# EAGLE board warp-revA (EAGLE 8.6.3)
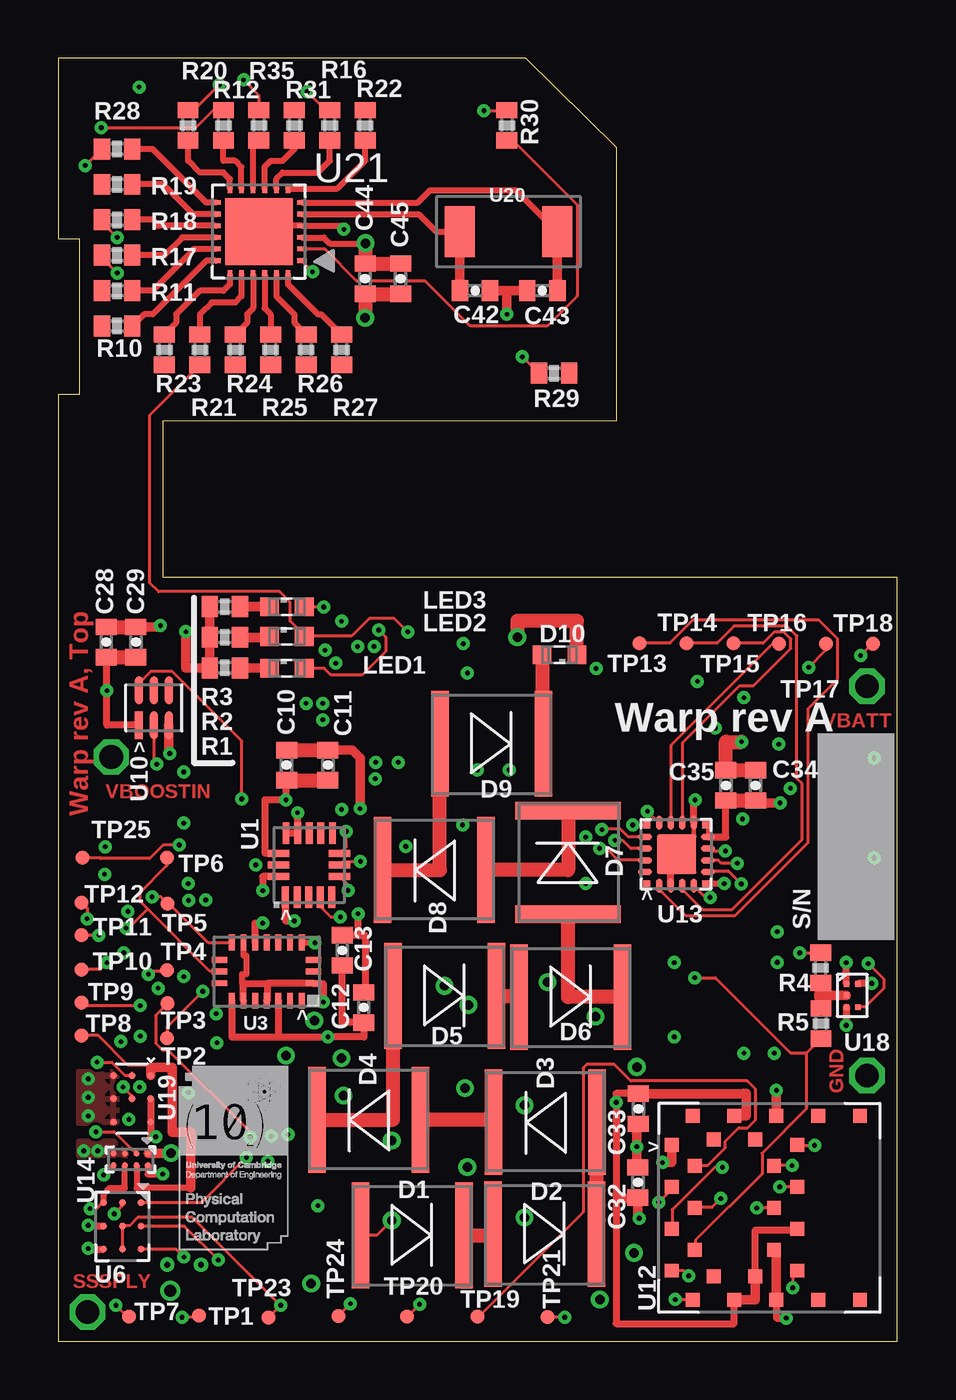
[diagram p5: board, top side]
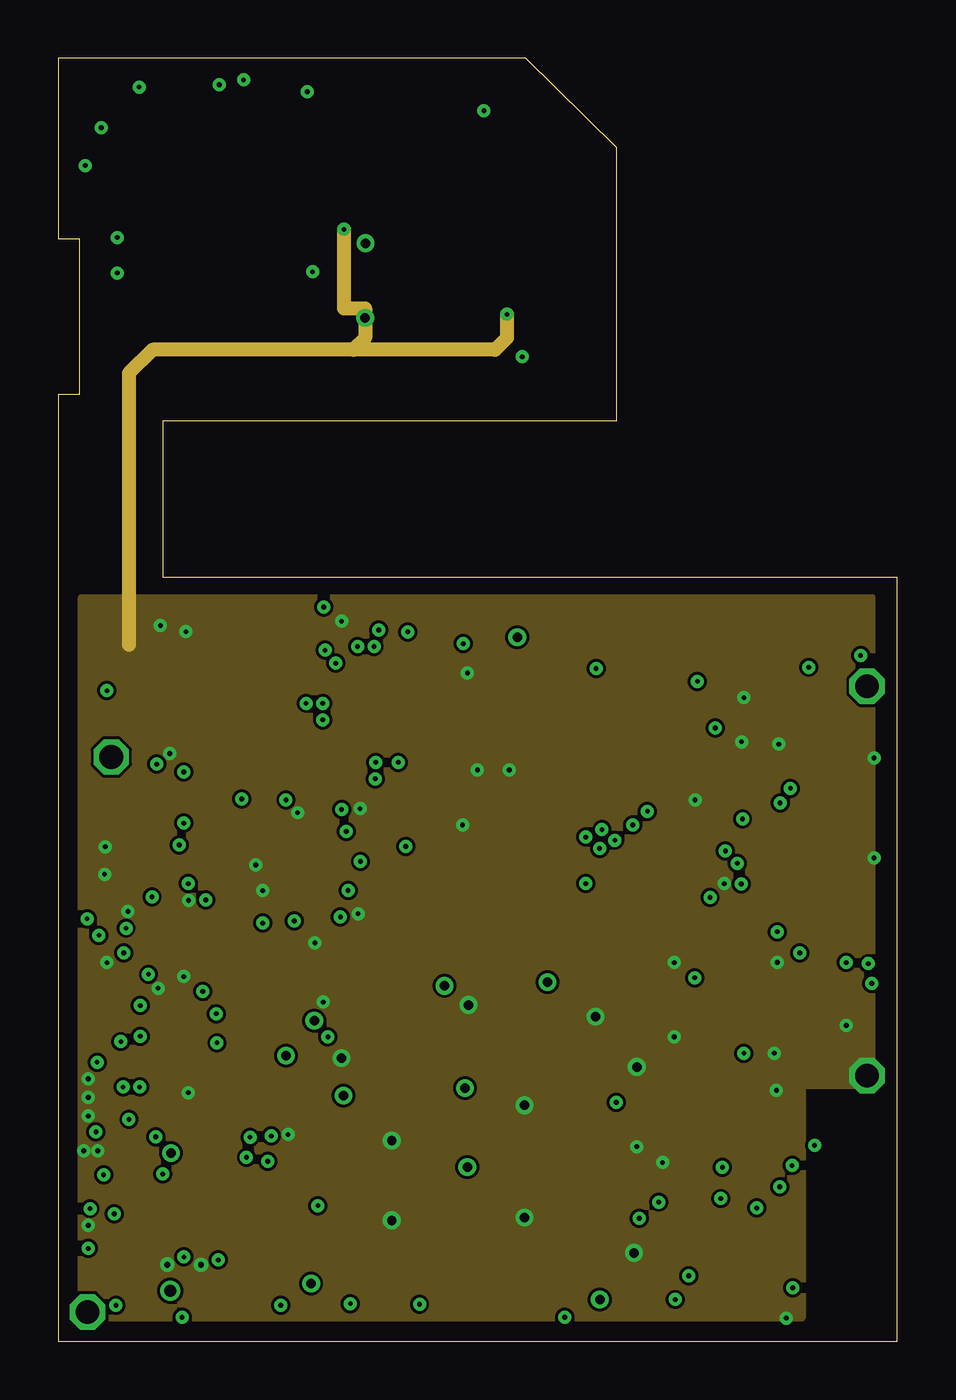
[diagram p6: board, inner layer Route2]
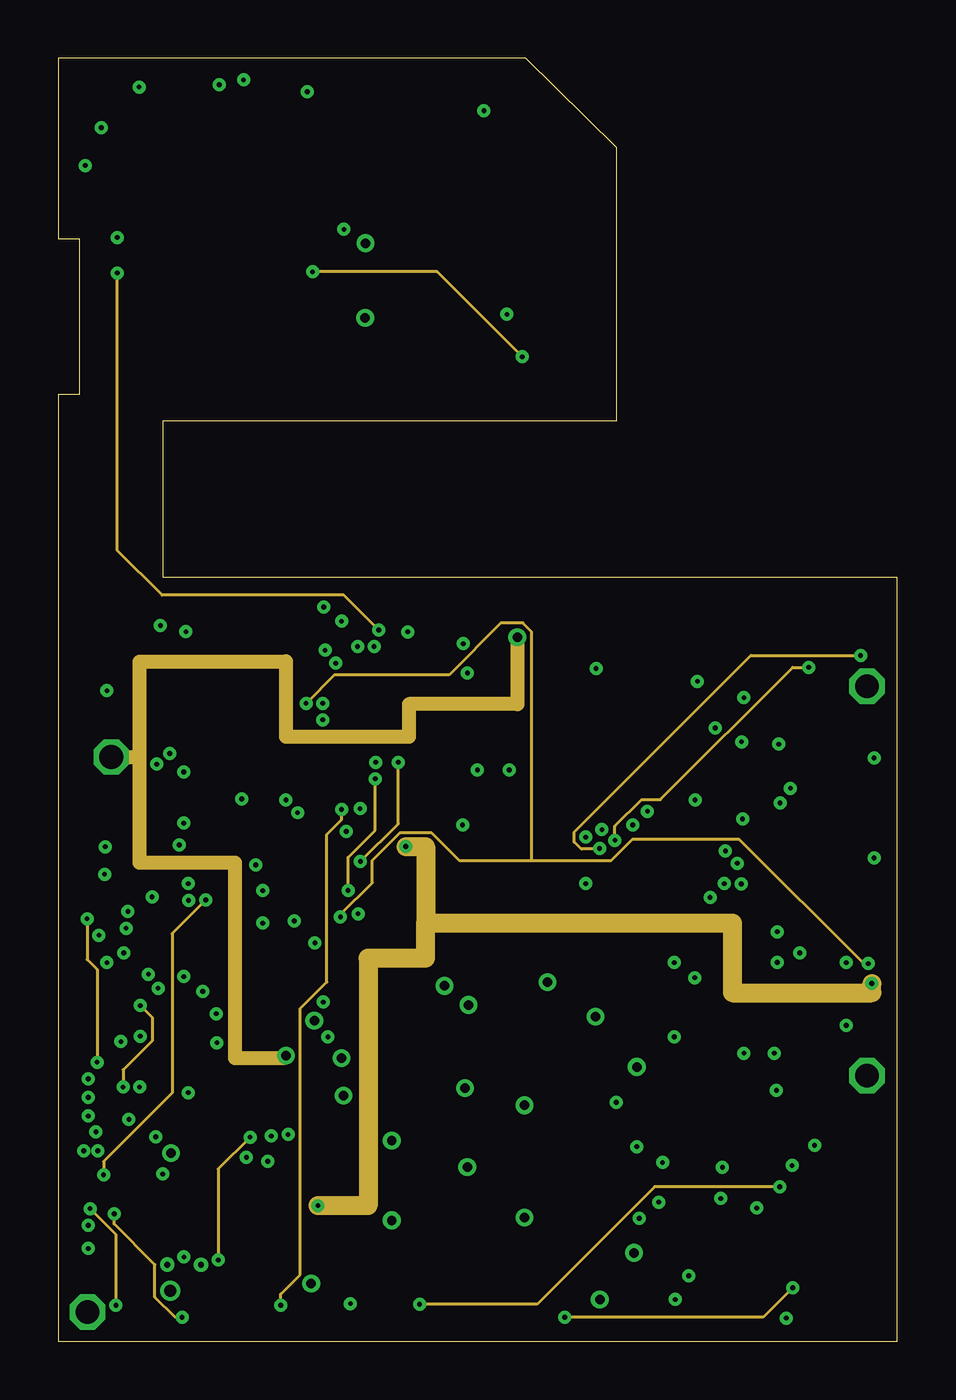
[diagram p7: board, inner layer Route3]
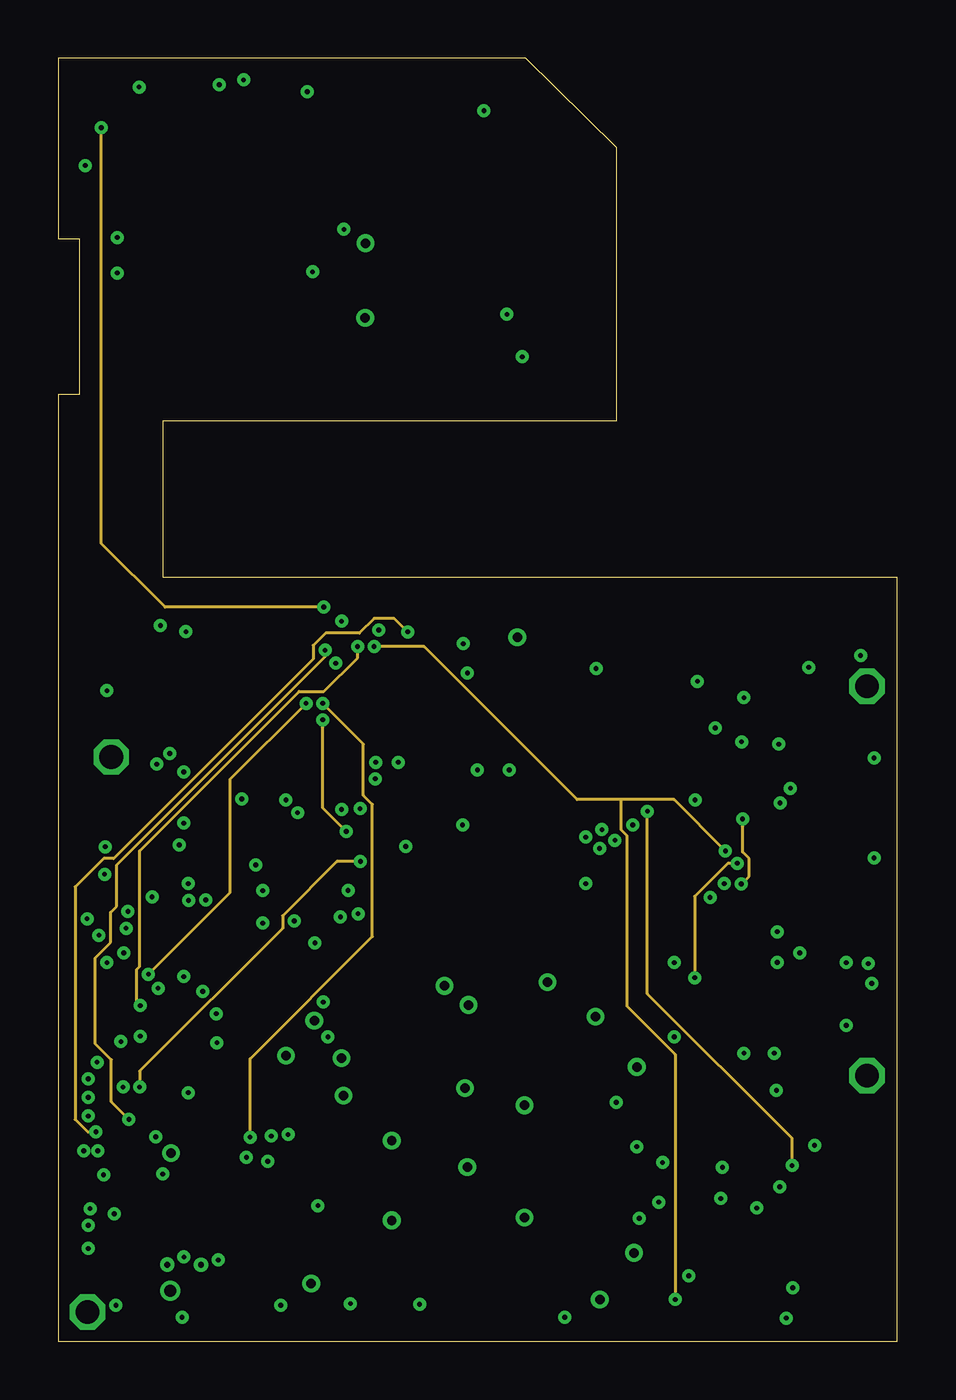
[diagram p8: board, inner layer Route4]
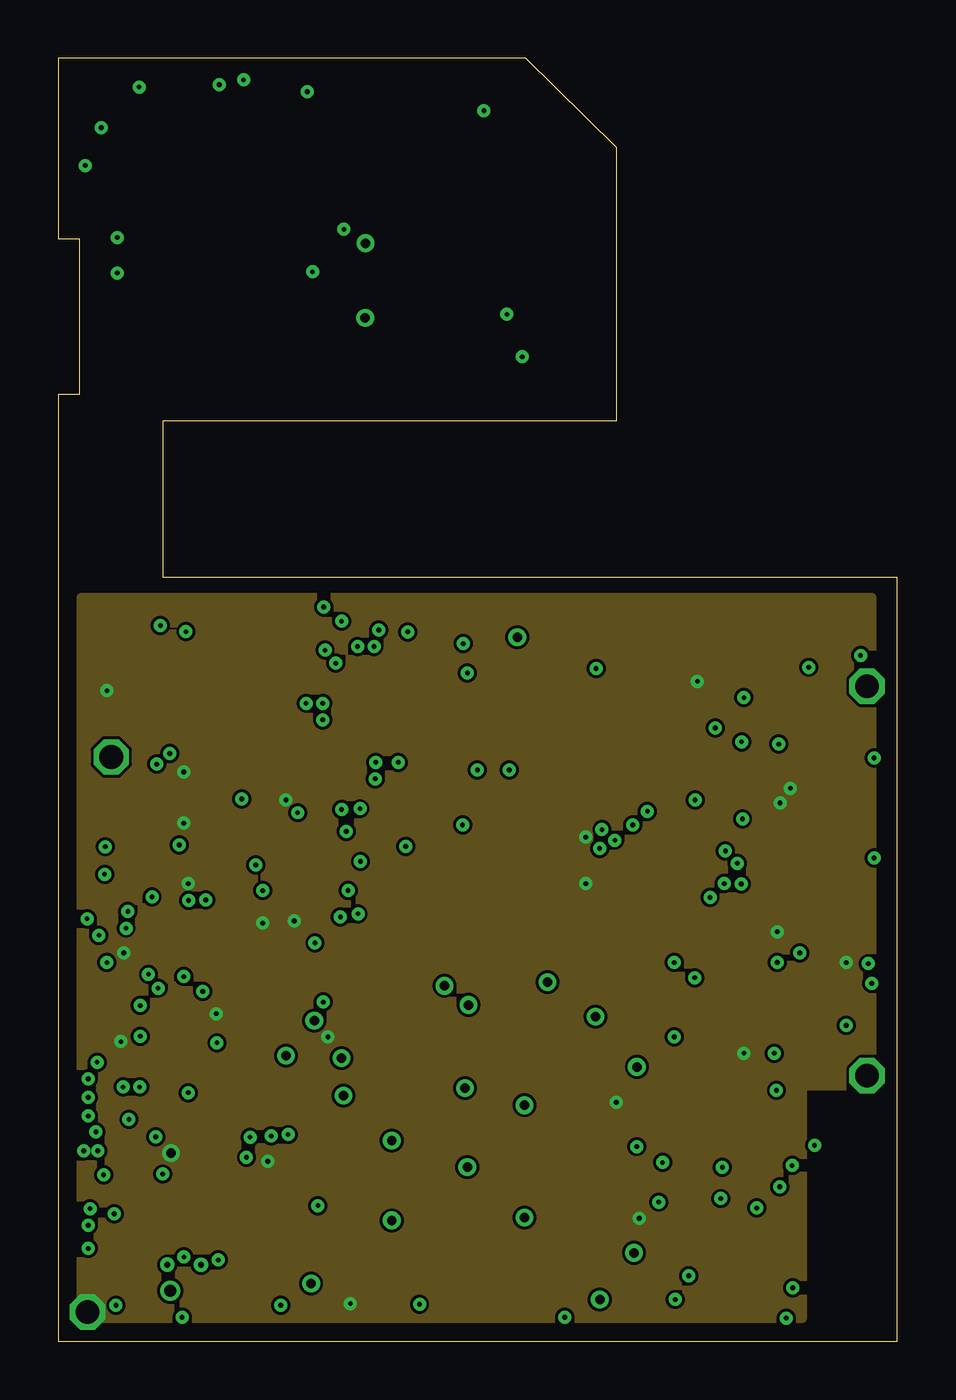
[diagram p9: board, inner layer Route5]
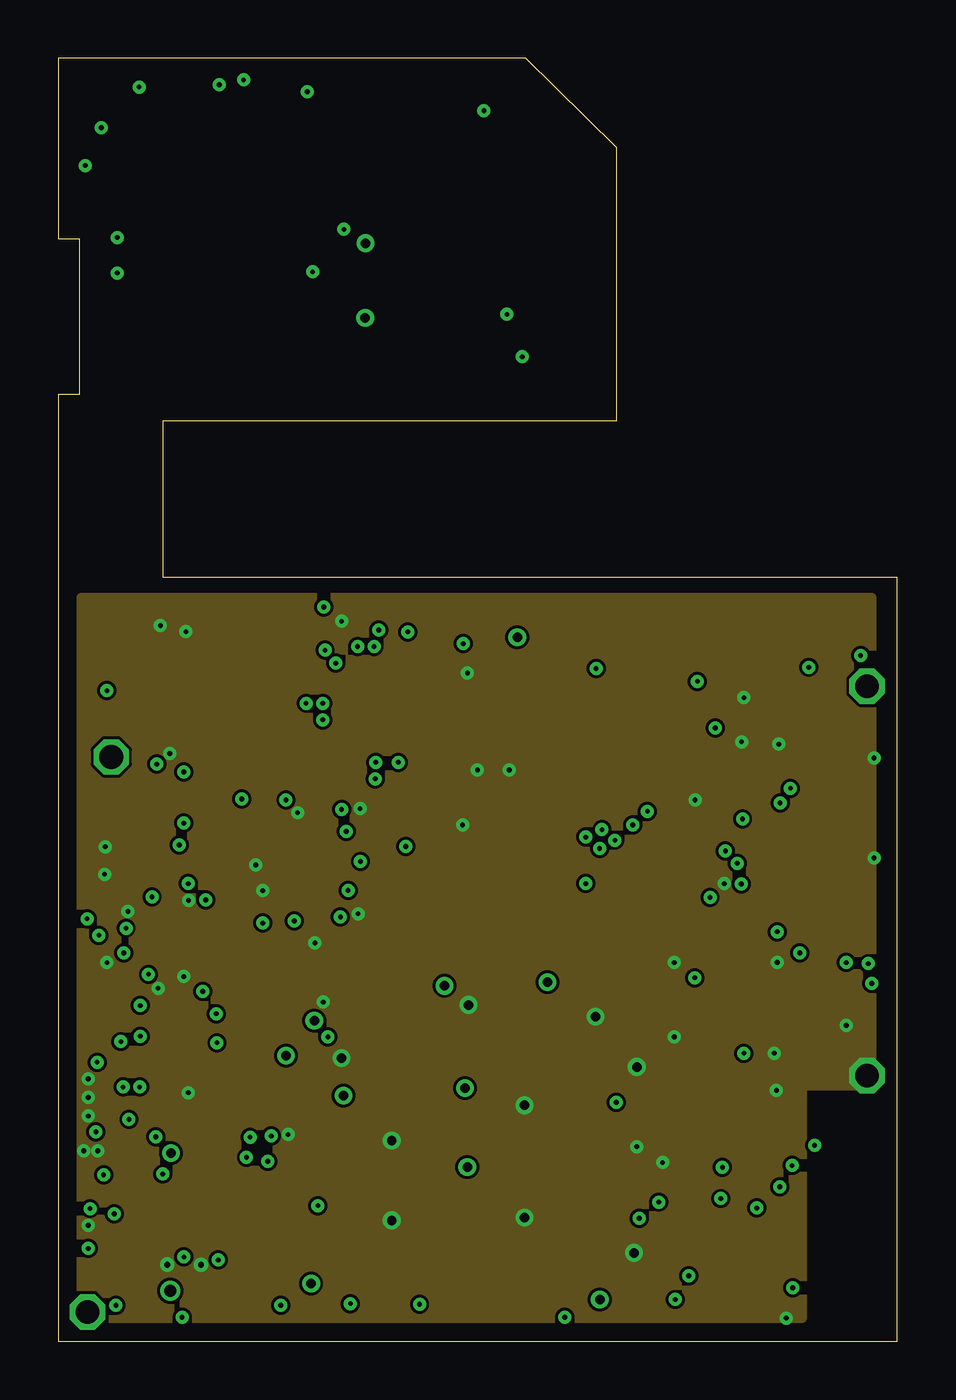
[diagram p10: board, inner layer Route6]
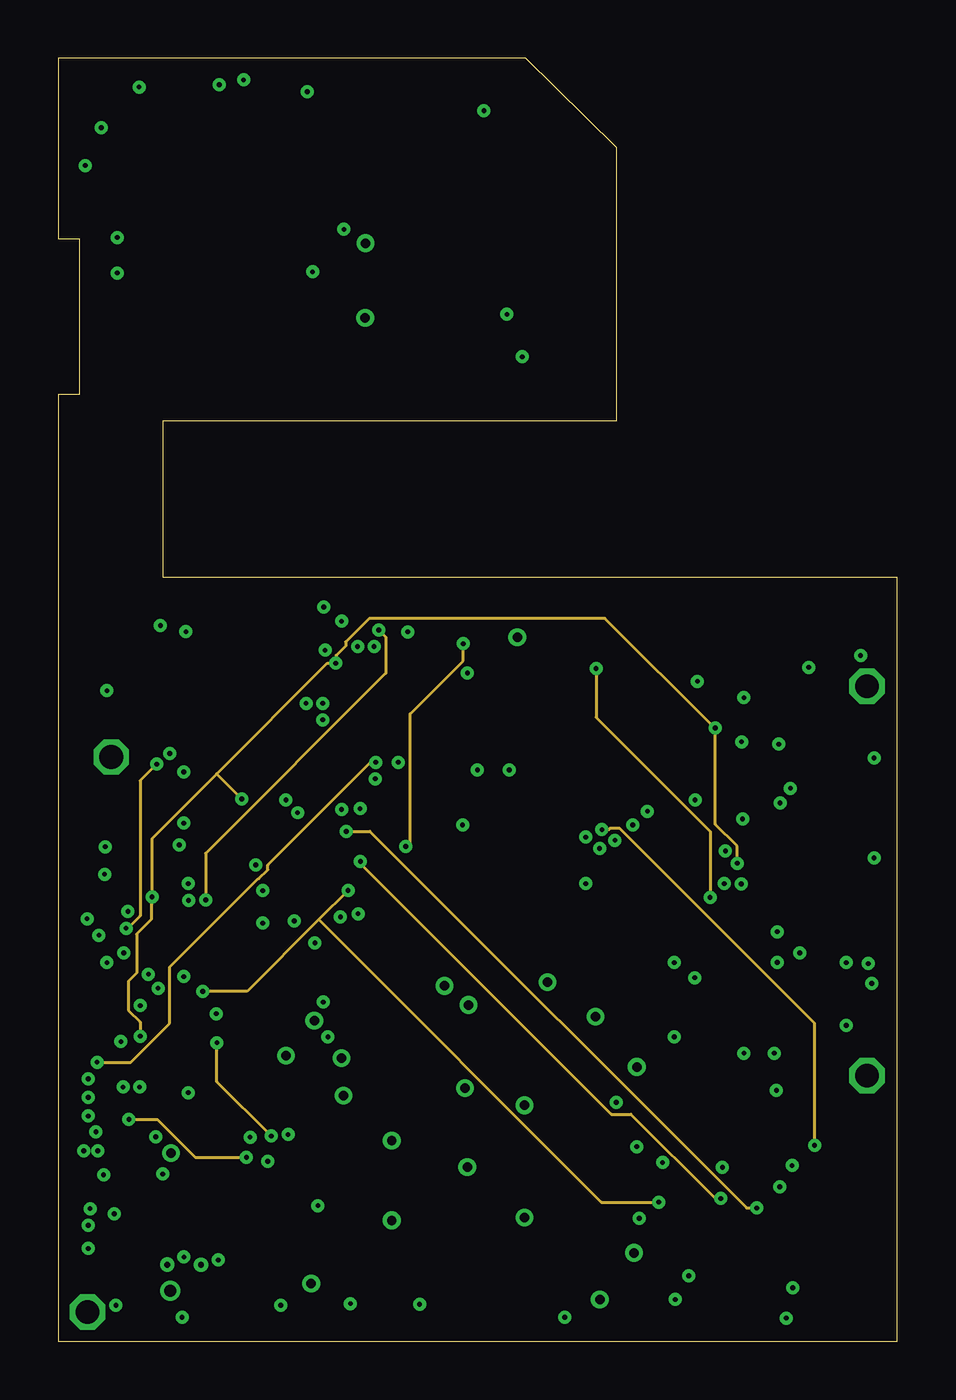
[diagram p11: board, inner layer Route7]
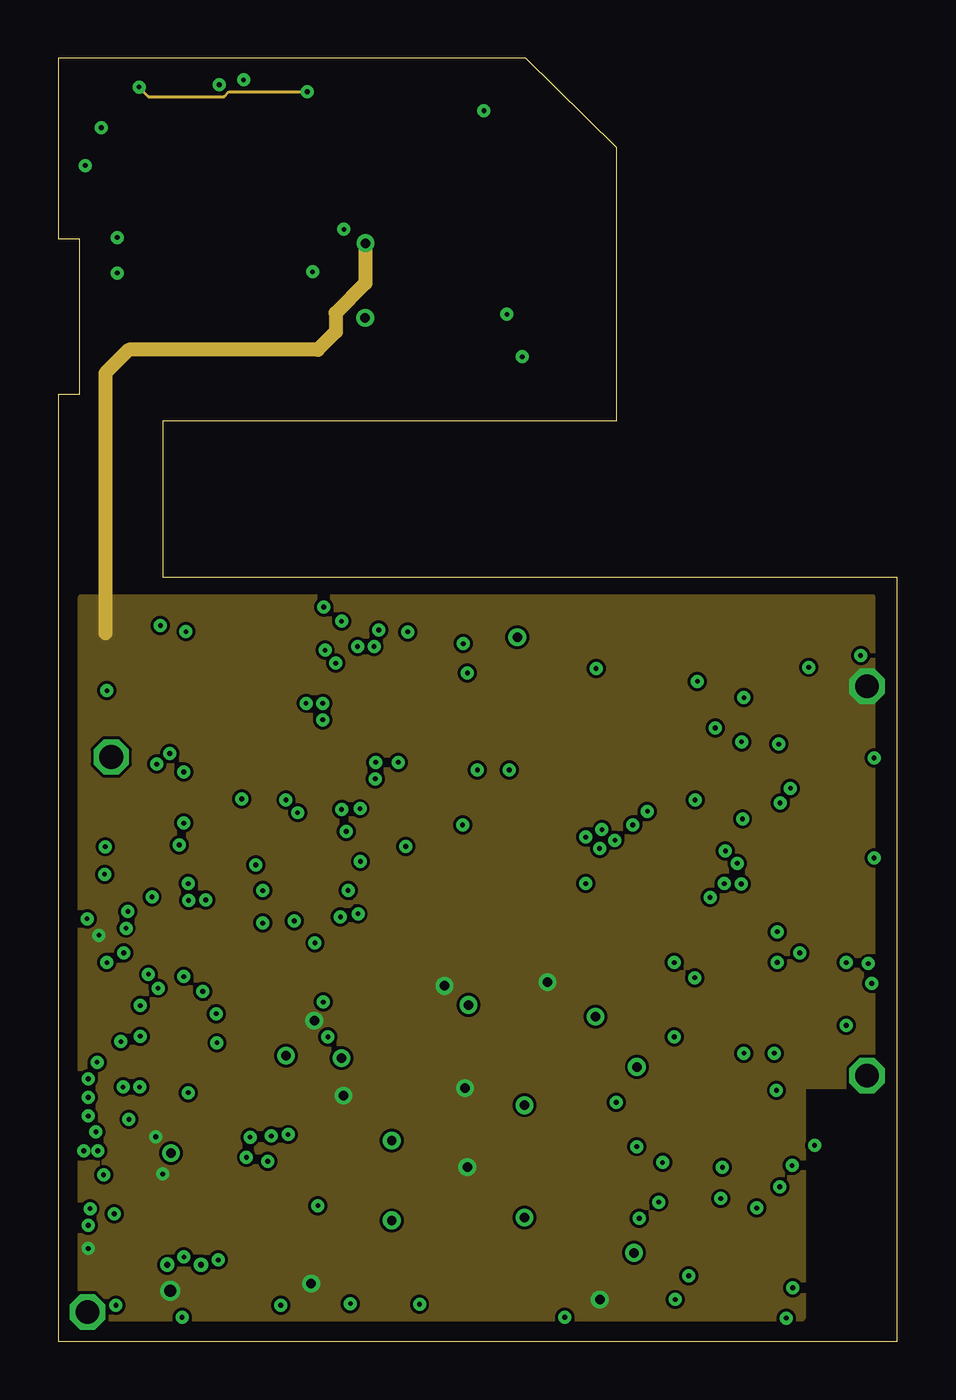
[diagram p12: board, inner layer Route14]
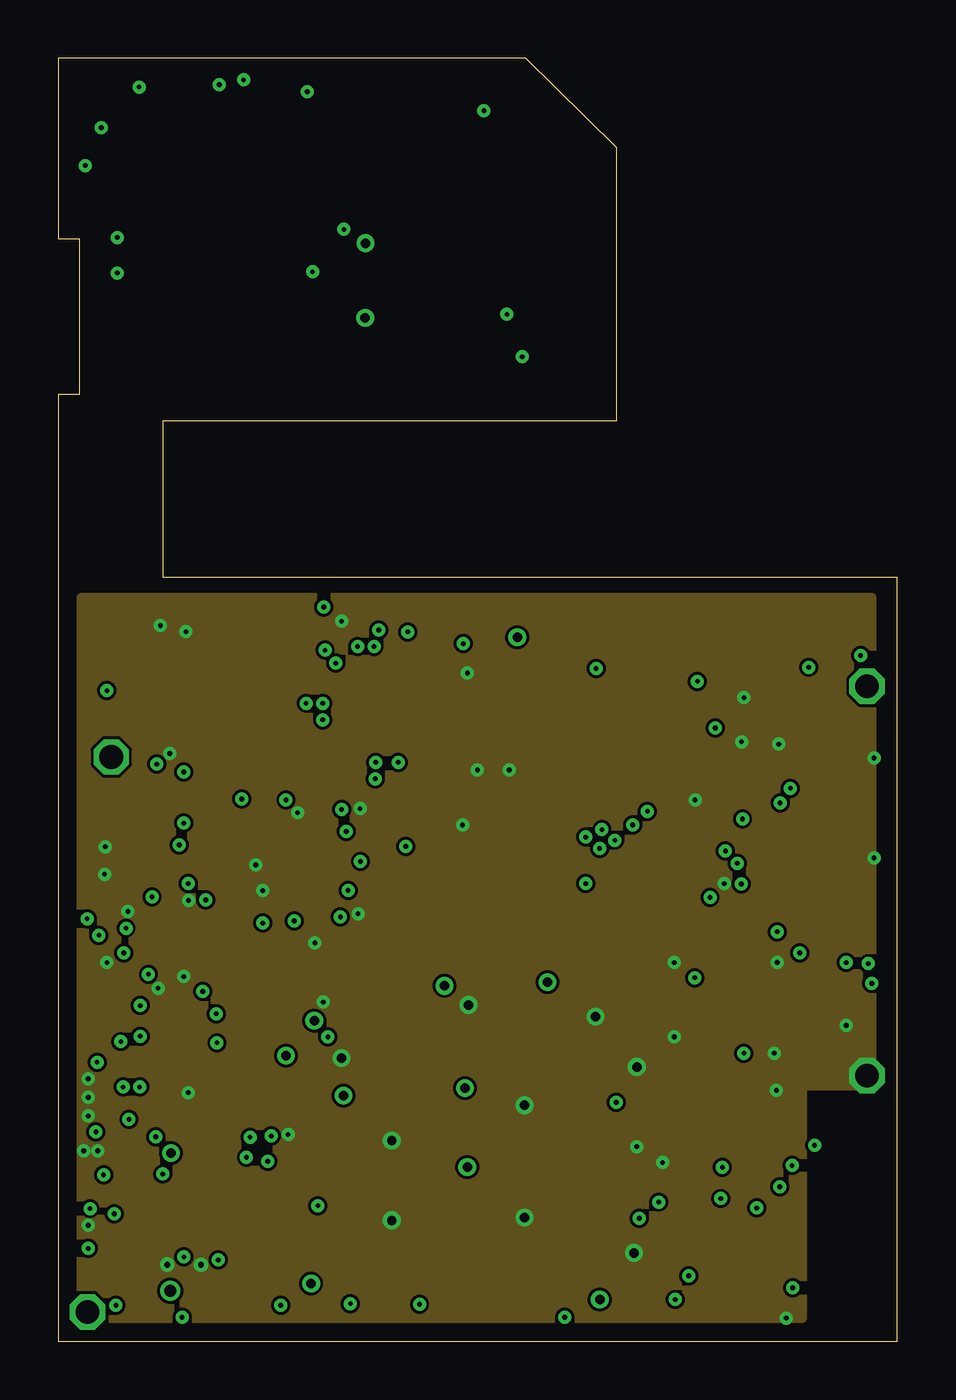
[diagram p13: board, inner layer Route15]
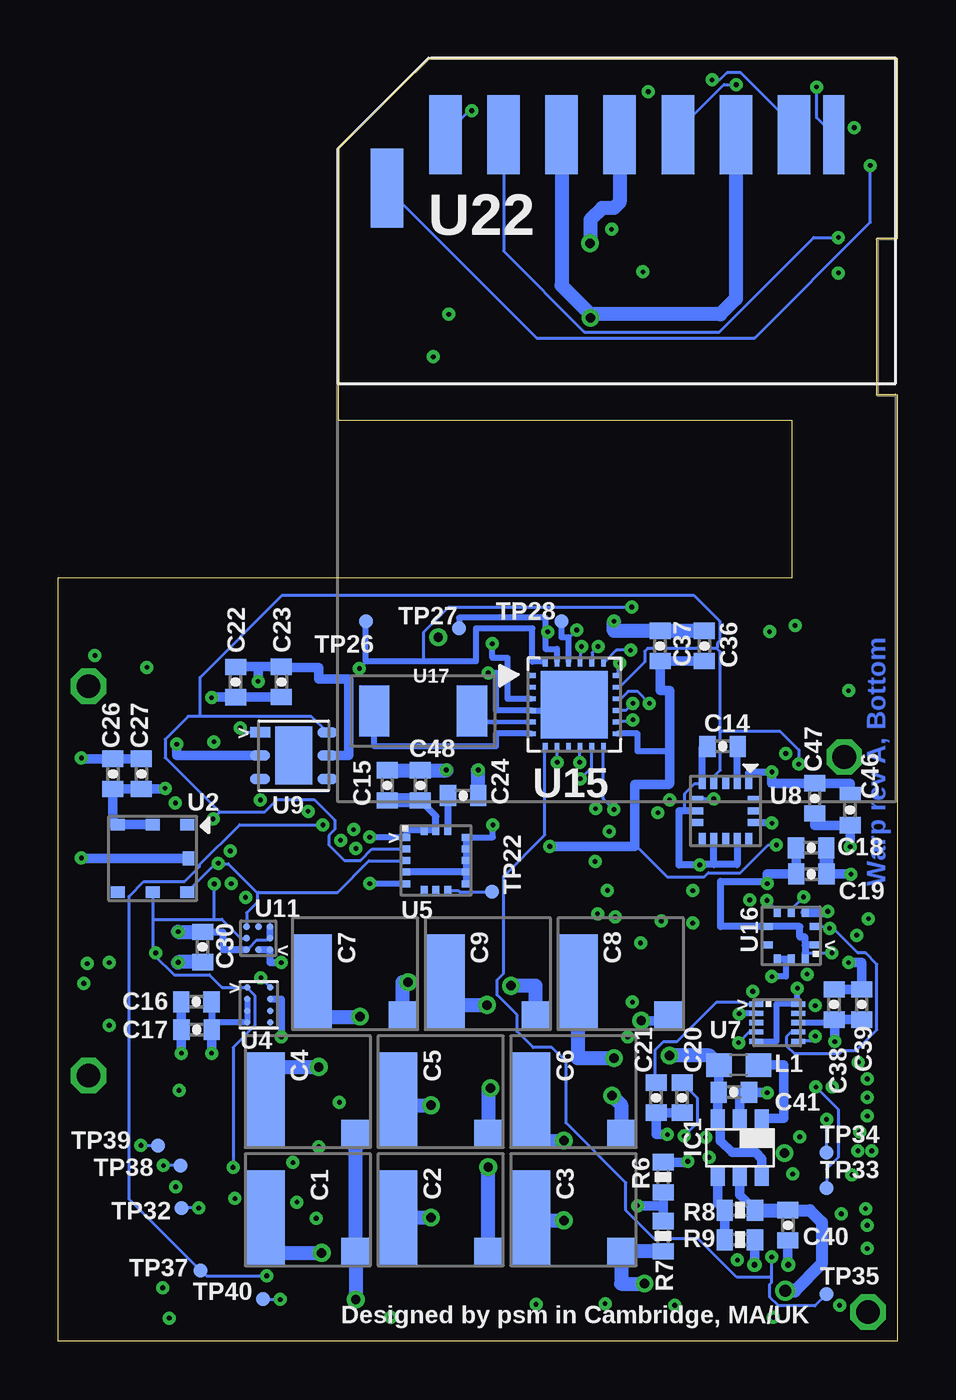
[diagram p14: board, bottom side, seen from below]

Size 36.1 x 55.22 mm. Coordinates in mm from the lower left corner, seen from the top.
Outline: 0,0 36.1,0 36.1,32.87 4.52,32.87 4.52,39.62 24.03,39.62 24.03,51.36 20.12,55.22 0,55.22 0,47.45 0.91,47.45 0.91,40.74 0,40.74 0,0
Copper layers (1+2*3+4*5+6*7+14*15+16): Top 0.035mm / dielectric 0.1mm / Route2 0.035mm / dielectric 0.18mm / Route3 0.035mm / dielectric 0.1mm / Route4 0.035mm / dielectric 0.15mm / Route5 0.035mm / dielectric 0.2mm / Route6 0.035mm / dielectric 0.15mm / Route7 0.035mm / dielectric 0.2mm / Route14 0.035mm / dielectric 0.18mm / Route15 0.035mm / dielectric 0.1mm / Bottom 0.035mm
Design rules "default": minimum track width 5mil, minimum drill 8mil, track to track 5mil, track to pad 5mil, pad to pad 5mil, via to via 6mil, smd to smd 5mil, copper to edge 20mil, drill to drill 15mil, minimum pad ring 7mil, minimum via ring 7mil, stop-mask expansion 4mil, vias tented up to drill 10mil, thermal gap 10mil

## Footprints (pad centres in the part's own frame; a part is rotated, then mirrored left to right if it is on the bottom)
XH414HGIV01E = smd 1.2 x 1.2: + 1.806,1.817 | smd 4.1 x 1.7: - 0.356,-2.083
0402-CAP = smd 0.7 x 0.9: 1 -0.65,0; 2 0.65,0
TEMD5080 = smd 0.75 x 4.55: P$1 -2.159,0; P$2 2.291,0
SML0603 = smd 0.8 x 0.8: A 0.75,0; C -0.75,0
TSOT23-6_DDC = smd 0.6 x 0.8: 1 -0.95,-1.25; 2 0,-1.25; 3 0.95,-1.25; 4 0.95,1.25; 5 0,1.25; 6 -0.95,1.25
0603 = smd 1.1 x 1: 1 -0.85,0; 2 0.85,0
0402-RES = smd 0.7 x 0.9: 1 -0.65,0; 2 0.65,0
TP06R = smd 0.6 x 0.6: TP 0,0
ADXL362 = smd 0.925 x 0.3: P$1 -1.274,1.001; P$2 -1.274,0.501; P$3 -1.274,0.001; P$4 -1.274,-0.499; P$5 -1.274,-0.999; P$9 1.476,-1.024; P$10 1.476,-0.524; P$11 1.476,-0.024; P$12 1.476,0.476; P$13 1.476,0.976 | smd 0.3 x 0.925: P$6 -0.399,-1.324; P$7 0.101,-1.324; P$8 0.601,-1.324; P$14 0.601,1.301; P$15 0.101,1.301; P$16 -0.399,1.301
BMP180 = smd 0.6 x 0.5: P$1 -1.478,-1.45; P$2 0.022,-1.45; P$3 1.522,-1.45; P$4 1.522,1.45; P$5 0.022,1.45; P$6 -1.478,1.45 | smd 0.5 x 0.6: P$7 -1.528,0
BMX055 = smd 0.25 x 0.675: P$1 -1.536,1.226; P$2 -1.036,1.226; P$3 -0.536,1.226; P$4 -0.036,1.226; P$5 0.464,1.226; P$6 0.964,1.226; P$7 1.464,1.226; P$11 1.464,-1.274; P$12 0.964,-1.274; P$13 0.464,-1.274; P$14 -0.036,-1.274; P$15 -0.536,-1.274; P$16 -1.036,-1.274; P$17 -1.536,-1.274 | smd 0.675 x 0.25: P$8 1.989,0.476; P$9 1.989,-0.024; P$10 1.989,-0.524; P$18 -2.051,-0.524; P$19 -2.051,-0.024; P$20 -2.051,0.476
HDC1000 = smd 0.275 x 0.275: A1 -0.5,0.8; A2 0.5,0.8; B1 -0.5,0.3; B2 0.5,0.3; C1 -0.5,-0.2; C2 0.5,-0.2; D1 -0.5,-0.7; D2 0.5,-0.7
L3GD20H = smd 0.4 x 0.3: P$1 -1.324,0.976; P$2 -1.324,0.476; P$3 -1.324,-0.024; P$4 -1.324,-0.524; P$5 -1.324,-1.024; P$9 1.276,-1.024; P$10 1.276,-0.524; P$11 1.276,-0.024; P$12 1.276,0.476; P$13 1.276,0.976 | smd 0.3 x 0.4: P$6 -0.524,-1.324; P$7 -0.024,-1.324; P$8 0.476,-1.324; P$14 0.476,1.276; P$15 -0.024,1.276; P$16 -0.524,1.276
TPS82740 = smd 0.3 x 0.3: A1 -1,0.8; A2 0,0.8; A3 1,0.8; B1 -1,0; B2 0,0; B3 1,0; C1 -1,-0.8; C2 0,-0.8; C3 1,-0.8
MAG3110 = smd 0.6 x 0.225: P$1 -0.916,0.784; P$2 -0.916,0.384; P$3 -0.916,-0.016; P$4 -0.916,-0.416; P$5 -0.916,-0.816; P$6 0.884,-0.816; P$7 0.884,-0.416; P$8 0.884,-0.016; P$9 0.884,0.384; P$10 0.884,0.784
MMA8451Q = smd 0.6 x 0.3: P$1 -1.274,0.976; P$2 -1.274,0.476; P$3 -1.274,-0.024; P$4 -1.274,-0.524; P$5 -1.274,-1.024; P$9 1.226,-1.024; P$10 1.226,-0.524; P$11 1.226,-0.024; P$12 1.226,0.476; P$13 1.226,0.976 | smd 0.3 x 0.6: P$6 -0.524,-1.274; P$7 -0.024,-1.274; P$8 0.476,-1.274; P$14 0.476,1.226; P$15 -0.024,1.226; P$16 -0.524,1.226
SI7021 = smd 0.85 x 0.45: P$1 -1.5,1.05; P$2 -1.5,0.05; P$3 -1.5,-0.95; P$4 1.4,-0.95; P$5 1.4,0.05; P$6 1.4,1.05 | smd 1.6 x 2.5: P$7 -0.05,0.05
TCS3772 = smd 1.2 x 0.35: P$1 -0.8,0.7; P$2 -0.8,0.05; P$3 -0.8,-0.6; P$4 0.7,-0.6; P$5 0.7,0.05; P$6 0.7,0.7
TMP006B = smd 0.3 x 0.3: A1 0.488,-0.512; A2 -0.012,-0.512; A3 -0.512,-0.512; B1 0.488,-0.012; B3 -0.512,-0.012; C1 0.488,0.488; C2 -0.012,0.488; C3 -0.512,0.488
PAN1326B = smd 0.6 x 0.6: A -4,2.8; B 3.9,2.8; C -4,4.6; D 3.9,4.6; P$1 -2.75,-3.5; P$2 -1.85,-2.5; P$3 -0.95,-3.5; P$4 -0.05,-2.5; P$5 0.85,-3.5; P$6 1.75,-2.5; P$7 2.65,-3.5; P$8 3.9,-2.6; P$9 2.9,-1.7; P$10 3.9,-0.8; P$11 2.9,0.1; P$12 3.9,1; P$13 2.65,1.9; P$14 1.75,0.9; P$15 0.85,1.9; P$16 -0.05,0.9; P$17 -0.95,1.9; P$18 -1.85,0.9; P$19 -2.75,1.9; P$20 -4,1; P$21 -3,0.1; P$22 -4,-0.8; P$23 -3,-1.7; P$24 -4,-2.6
SI4705 = smd 0.3 x 0.3: P$1 -1.31,1.28; P$6 -1.31,-1.25; P$11 1.22,-1.25; P$16 1.22,1.28 | smd 0.61 x 0.28: P$2 -1.4,0.75; P$3 -1.4,0.25; P$4 -1.4,-0.25; P$5 -1.4,-0.75; P$12 1.31,-0.75; P$13 1.31,-0.25; P$14 1.31,0.25; P$15 1.31,0.75 | smd 0.28 x 0.61: P$7 -0.8,-1.35; P$8 -0.3,-1.35; P$9 0.2,-1.35; P$10 0.7,-1.35; P$17 0.7,1.36; P$18 0.2,1.36; P$19 -0.3,1.36; P$20 -0.8,1.36 | smd 1.7 x 1.7: P$21 -0.05,0
TS5A3154 = smd 0.25 x 0.25: A1 0.25,-0.75; A2 -0.25,-0.75; B1 0.25,-0.25; B2 -0.25,-0.25; C1 0.25,0.25; C2 -0.25,0.25; D1 0.25,0.75; D2 -0.25,0.75
MKL03Z32VFK4R = smd 0.4 x 0.2: P$1 -1.85,1.25; P$2 -1.85,0.75; P$3 -1.85,0.25; P$4 -1.85,-0.25; P$5 -1.85,-0.75; P$6 -1.85,-1.25; P$13 1.85,-1.25; P$14 1.85,-0.75; P$15 1.85,-0.25; P$16 1.85,0.25; P$17 1.85,0.75; P$18 1.85,1.25 | smd 0.2 x 0.4: P$7 -1.25,-1.85; P$8 -0.75,-1.85; P$9 -0.25,-1.85; P$10 0.25,-1.85; P$11 0.75,-1.85; P$12 1.25,-1.85; P$19 1.25,1.85; P$20 0.75,1.85; P$21 0.25,1.85; P$22 -0.25,1.85; P$23 -0.75,1.85; P$24 -1.25,1.85 | smd 2.9 x 2.9: P$PAD 0,0
LPS25H = smd 0.3 x 0.4: P$1 0.38,0.98; P$2 -0.42,0.98; P$6 -0.42,-1.02; P$7 0.38,-1.02 | smd 0.4 x 0.3: P$3 -1.02,0.58; P$4 -1.02,-0.02; P$5 -1.02,-0.62; P$8 0.98,-0.62; P$9 0.98,-0.02; P$10 0.98,0.58
CM519 = smd 1.3 x 2.2: P$1 0,0; P$2 4.2,0
R-XBGA-N5 = smd 0.25 x 0.25: A1 0,-0.5; A2 -0.5,-0.5; B1 0,0; C1 0,0.5; C2 -0.5,0.5
MICROSIP-8 = smd 0.3 x 0.3: A1 -1,0.797; A2 0,0.797; A3 1,0.797; B1 -1,-0.003; B2 0,-0.003; C1 -1,-0.803; C2 0,-0.803; C3 1,-0.803
SDCARD-PADS = smd 1.4 x 3.4: 1 -7.51,14.48; 2 -5.01,14.48; 3 -2.51,14.48; 4 -0.01,14.48; 5 2.49,14.48; 6 4.99,14.48; 7 7.49,14.48; 9 -10.01,12.18 | smd 0.9 x 3.4: 8 9.19,14.48

## Placement (x,y rotation side)
C1  XH414HGIV01E  [XH414HGIV01E]  25.13,5.67 270 bottom
C2  XH414HGIV01E  [XH414HGIV01E]  19.41,5.67 270 bottom
C3  XH414HGIV01E  [XH414HGIV01E]  13.7,5.67 270 bottom
C4  XH414HGIV01E  [XH414HGIV01E]  25.13,10.75 270 bottom
C5  XH414HGIV01E  [XH414HGIV01E]  19.41,10.75 270 bottom
C6  XH414HGIV01E  [XH414HGIV01E]  13.7,10.75 270 bottom
C7  XH414HGIV01E  [XH414HGIV01E]  23.1,15.83 270 bottom
C8  XH414HGIV01E  [XH414HGIV01E]  11.67,15.83 270 bottom
C9  XH414HGIV01E  [XH414HGIV01E]  17.38,15.83 270 bottom
C10  0.1uF  [0402-CAP]  9.83,24.79 90 top
C11  0.1uF  [0402-CAP]  11.6,24.79 90 top
C12  0.1uF  [0402-CAP]  13.15,14.37 90 top
C13  0.1uF  [0402-CAP]  12.22,16.83 90 top
C14  0.1uF  [0402-CAP]  7.52,25.61 180 bottom
C15  10uF  [0402-CAP]  21.95,23.93 90 bottom
C16  0.1uF  [0402-CAP]  30.15,14.62 180 bottom
C17  1uF  [0402-CAP]  30.15,13.41 180 bottom
C18  0.1uF  [0402-CAP]  3.71,21.24 0 bottom
C19  4.7uF  [0402-CAP]  3.7,20.11 0 bottom
C20  0.1uF  [0402-CAP]  9.26,10.49 270 bottom
C21  0.1uF  [0402-CAP]  10.38,10.49 270 bottom
C22  1uF  [0402-CAP]  28.47,28.37 270 bottom
C23  0.1uF  [0402-CAP]  26.5,28.38 270 bottom
C24  10nF (25V)  [0402-CAP]  18.68,23.49 0 bottom
C26  0.1uF  [0402-CAP]  33.75,24.42 90 bottom
C27  0.1uF  [0402-CAP]  32.52,24.42 90 bottom
C28  0.1uF  [0402-CAP]  2.07,30.09 90 top
C29  1uF  [0402-CAP]  3.35,30.09 90 top
C30  10nF  [0402-CAP]  29.88,16.97 270 bottom
C32  0.1uF  [0402-CAP]  24.94,6.84 90 top
C33  10uF  [0402-CAP]  24.96,10.01 270 top
C34  0.1uF  [0402-CAP]  30,23.93 90 top
C35  22nF  [0402-CAP]  28.72,23.93 90 top
C36  0.1uF  [0402-CAP]  8.3,29.92 90 bottom
C37  0.1uF  [0402-CAP]  10.21,29.92 90 bottom
C38  0.1uF  [0402-CAP]  2.72,14.5 90 bottom
C39  1uF  [0402-CAP]  1.54,14.5 90 bottom
C40  10uF  [0402-CAP]  4.72,5 270 bottom
C41  4.7uF  [0402-CAP]  7.03,10.72 0 bottom
C42  33pF  [0402-CAP]  17.93,45.21 0 top
C43  33pF  [0402-CAP]  20.83,45.21 180 top
C44  0.1uF  [0402-CAP]  13.21,45.72 270 top
C45  0.1uF  [0402-CAP]  14.73,45.72 270 top
C46  0.1uF  [0402-CAP]  2.03,22.86 270 bottom
C47  0.1uF  [0402-CAP]  3.56,23.37 270 bottom
C48  0.1uF  [0402-CAP]  20.52,23.93 90 bottom
D1  TEMD5080  [TEMD5080]  15.16,4.57 0 top
D2  TEMD5080  [TEMD5080]  20.86,4.62 0 top
D3  TEMD5080  [TEMD5080]  21.02,9.44 180 top
D4  TEMD5080  [TEMD5080]  13.42,9.53 180 top
D5  TEMD5080  [TEMD5080]  16.56,14.87 0 top
D6  TEMD5080  [TEMD5080]  21.99,14.81 0 top
D7  TEMD5080  [TEMD5080]  21.93,20.55 90 top
D8  TEMD5080  [TEMD5080]  16.25,20.29 180 top
D9  TEMD5080  [TEMD5080]  18.58,25.72 0 top
D10  CHARGE_PATH_DIODE  [SML0603]  21.56,29.54 180 top
IC1  TPS61070DDC  [TSOT23-6_DDC]  6.78,8.33 180 bottom
L1  4.7uH  [0603]  6.83,11.89 0 bottom
LED1  [SML0603]  9.84,28.97 0 top
LED2  [SML0603]  9.84,30.33 0 top
LED3  [SML0603]  9.84,31.61 0 top
R1  0  [0402-RES]  7.17,28.98 0 top
R2  0  [0402-RES]  7.17,30.3 0 top
R3  0  [0402-RES]  7.17,31.62 0 top
R4  4.7K  [0402-RES]  32.8,16.07 270 top
R5  4.7K  [0402-RES]  32.82,13.68 90 top
R6  DNP  [0402-RES]  10.08,7.06 90 bottom
R7  0  [0402-RES]  10.08,4.52 270 bottom
R8  1M  [0402-RES]  6.78,5.65 180 bottom
R9  200k  [0402-RES]  6.78,4.38 180 bottom
R10  0  [0402-RES]  2.54,43.69 180 top
R11  0  [0402-RES]  2.54,45.21 180 top
R12  0  [0402-RES]  7.11,52.32 90 top
R16  0  [0402-RES]  11.68,52.32 90 top
R17  0  [0402-RES]  2.54,46.74 180 top
R18  0  [0402-RES]  2.54,48.26 180 top
R19  0  [0402-RES]  2.54,49.78 180 top
R20  0  [0402-RES]  5.59,52.32 90 top
R21  0  [0402-RES]  6.1,42.67 270 top
R22  0  [0402-RES]  13.21,52.32 90 top
R23  0  [0402-RES]  4.57,42.67 270 top
R24  0  [0402-RES]  7.62,42.67 270 top
R25  0  [0402-RES]  9.14,42.67 270 top
R26  0  [0402-RES]  10.67,42.67 270 top
R27  0  [0402-RES]  12.19,42.67 270 top
R28  0  [0402-RES]  2.54,51.31 0 top
R29  0  [0402-RES]  21.34,41.66 180 top
R30  0  [0402-RES]  19.3,52.32 270 top
R31  0  [0402-RES]  10.16,52.32 270 top
R35  0  [0402-RES]  8.64,52.32 270 top
TP1  TPSTP06R  [TP06R]  6.07,1.11 0 top
TP2  TPSTP06R  [TP06R]  4.69,13.04 0 top
TP3  TPSTP06R  [TP06R]  4.71,14.54 0 top
TP4  TPSTP06R  [TP06R]  4.69,15.97 270 top
TP5  TPSTP06R  [TP06R]  4.71,18.82 0 top
TP6  TPSTP06R  [TP06R]  4.69,20.82 0 top
TP7  TPSTP06R  [TP06R]  3.06,1.06 270 top
TP8  TPSTP06R  [TP06R]  1.01,13.16 0 top
TP9  TPSTP06R  [TP06R]  1.01,14.58 0 top
TP10  TPSTP06R  [TP06R]  1.01,15.99 180 top
TP11  TPSTP06R  [TP06R]  1.01,17.47 180 top
TP12  TPSTP06R  [TP06R]  1.01,18.89 90 top
TP13  TPTP06R  [TP06R]  25.01,30.04 0 top
TP14  TPTP06R  [TP06R]  27.03,30.04 0 top
TP15  TPTP06R  [TP06R]  29.04,30.04 0 top
TP16  TPTP06R  [TP06R]  31.01,30.03 0 top
TP17  TPTP06R  [TP06R]  33.03,30.03 0 top
TP18  TPTP06R  [TP06R]  35.04,30.03 0 top
TP19  TPTP06R  [TP06R]  18.03,1.06 0 top
TP20  TPTP06R  [TP06R]  15.01,1.06 0 top
TP21  TPTP06R  [TP06R]  21.04,1.04 180 top
TP22  TPTP06R  [TP06R]  17.44,19.35 270 bottom
TP23  TPSTP06R  [TP06R]  9.06,1.03 270 top
TP24  TPSTP06R  [TP06R]  12.06,1.1 270 top
TP25  TPSTP06R  [TP06R]  1.05,20.81 0 top
TP26  TPSTP06R  [TP06R]  22.86,30.99 180 bottom
TP27  TPSTP06R  [TP06R]  18.85,30.68 180 bottom
TP28  TPSTP06R  [TP06R]  14.45,30.99 180 bottom
TP32  TPSTP06R  [TP06R]  30.78,5.74 0 bottom
TP33  TPSTP06R  [TP06R]  3.05,6.6 0 bottom
TP34  TPSTP06R  [TP06R]  3.05,8.13 0 bottom
TP35  TPSTP06R  [TP06R]  3.05,2.03 0 bottom
TP37  TPTP06R  [TP06R]  29.97,3.05 0 bottom
TP38  TPTP06R  [TP06R]  30.84,7.57 0 bottom
TP39  TPTP06R  [TP06R]  31.8,8.43 0 bottom
TP40  TPSTP06R  [TP06R]  27.28,1.83 0 bottom
U1  ADXL362  [ADXL362]  10.78,20.4 90 top
U2  BMP180  [BMP180]  32.02,20.78 180 bottom
U3  BMX055  [BMX055]  8.94,15.89 180 top
U4  HDC1000  [HDC1000]  27.47,14.43 0 bottom
U5  L3GD20H  [L3GD20H]  19.83,20.72 0 bottom
U6  TPS82740  [TPS82740]  2.76,4.97 270 top
U7  MAG3110  [MAG3110]  5.16,13.73 0 bottom
U8  MMA8451Q  [MMA8451Q]  7.37,22.8 270 bottom
U9  SI7021  [SI7021]  25.91,25.15 0 bottom
U10  TCS3772  [TCS3772]  4.17,27.32 90 top
U11  TMP006B  [TMP006B]  27.48,17.36 0 bottom
U12  PAN1326B  [PAN1326B]  29.89,5.7 270 top
U13  SI4705  [SI4705]  26.6,21 90 top
U14  TS5A3154  [TS5A3154]  3.12,7.83 90 top
U15  MKL03Z32CAF4RQFN24  [MKL03Z32VFK4R]  13.9,27.4 0 bottom
U16  LPS25H  [LPS25H]  4.55,17.43 270 bottom
U17  CM519-SMD  [CM519]  18.3,27.12 180 bottom
U18  TS5A1066YZP  [R-XBGA-N5]  33.91,14.89 180 top
U19  TPS8267XMICROSIP8  [MICROSIP-8]  3.18,10.44 270 top
U20  CM519-SMD  [CM519]  17.27,47.75 0 top
U21  MKL03Z32CAF4RQFN24  [MKL03Z32VFK4R]  8.64,47.75 180 top
U22  SDCARD-PADS  [SDCARD-PADS]  11.94,37.44 0 bottom

## Tracks (layer width: path | path; a pad name or v marks a point on that pad's centre or on a via)
ADXL362_CS/PAN1326_!SHUTD  (via drill 0.2)
  Top 0.127: v30.05,5.74 U12.P$16 | v12.39,21.95 12.39,21.29 12.12,21.01 U1.P$8
  Route4 0.127: v11.38,26.75 11.38,22.96 v12.39,21.95
  Route7 0.127: v30.05,5.74 29.62,5.74 13.41,21.95 v12.39,21.95
  Bottom 0.127: v30.05,5.74 U12.P$16 | v11.38,26.75 11.46,26.67 12.04,26.67 U15.P$14
CPU1_EXTAL0
  Top 0.254: U21.P$5 15.51,48.5 16.26,47.75 U20.P$1
  Top 0.406: C42.1 17.28,47.74 U20.P$1
CPU1_PTA6  (via drill 0.2)
  Top 0.127: v10.72,53.77 11.51,52.98 11.68,52.98 R16.2
  Route14 0.127: v10.72,53.77 7.34,53.77 7.14,53.57 3.89,53.57 v3.48,53.98
  Bottom 0.127: v3.48,53.98 3.48,52.65 2.77,51.94 U22.8
CPU1_PTB1  (via drill 0.2)
  Top 0.127: v1.17,50.6 R28.1
  Bottom 0.127: v1.17,50.6 1.17,48.16 6.15,43.18 15.52,43.18 21.95,49.61 U22.9
CPU1_XTAL0
  Top 0.254: U21.P$6 15.47,49 16,49.53 19.69,49.53 U20.P$2
  Top 0.406: C43.1 U20.P$2
FAKE_SDIO_CLK  (via drill 0.2)
  Top 0.127: v6.93,54.08 5.84,52.98 5.59,52.98 R20.2
  Bottom 0.127: v6.93,54.08 7.47,54.08 9.42,52.12 9.42,51.94 U22.5
FAKE_SDIO_CS  (via drill 0.2)
  Top 0.127: v18.31,52.96 R30.1
  Bottom 0.127: v18.31,52.96 18.41,52.96 19.43,51.94 U22.1
FAKE_SDIO_DI  (via drill 0.2)
  Top 0.127: v2.54,47.5 1.91,48.13 1.91,48.26 R18.2
  Bottom 0.127: v2.54,47.5 3.61,47.5 7.67,43.43 13.46,43.43 16.94,46.91 U22.2
FAKE_SDIO_DO  (via drill 0.2)
  Top 0.127: R35.1 8.64,53.62 v7.98,54.28
  Bottom 0.127: v7.98,54.28 7.64,54.28 7.34,54.59 6.73,54.59 4.47,52.32 4.47,51.94 U22.7
GND  (via drill 0.2, 0.25, 0.41, 1.02)
  Top 0.127: U13.P$6 27.86,19.71 27.86,19.7 | TP10.TP 1.02,16 1.8,16 2.08,16.28 v2.1,16.3 | C12.2 13.16,15.04 13.16,15.11 13.21,15.24 | 9.14,47.75 U21.P$PAD | v14.35,5.21 13.72,4.57 D1.P$1
  Top 0.203: U13.P$12 27.35,20.95 U13.P$21
  Top 0.254: U13.P$6 27.86,19.7 v28.65,19.7 | U3.P$12 7.97,16.6 8.1,16.6 8.1,15.8 7.9,15.8 7.9,15.4 8.5,15.4 | U3.P$17 11.05,17.16 v11.05,17.14 | 9.14,47.75 9.39,48 U21.P$4 12.14,48 v12.29,47.85
  Top 0.305: U1.P$16 8.8,20 v8.8,19.4 | U1.P$13 U1.P$12 v10.3,22.75 | U18.C1 v33.91,13.6 v33.9,13.6 | U13.P$3 26.35,20.7 U13.P$21 | U12.P$12 30.9,1 v31.32,1 | 12.9,17.48 C13.2 | U3.P$20 | U3.P$20 9,15.4 | 9,15.4 9,14.66 U3.P$4 | U3.P$6 7.97,15.4 8.5,15.4 9,15.4 | U3.P$20 11.4,15.4 v11.4,14.6 | 12.9,17.48 v12.9,18.4 | U13.P$12 27.35,23.3 v27.4,23.3 | v1.3,5 1.3,4.97 U6.C2 | 12.9,17.48 13.21,17.48 13.21,15.24
  Top 0.406: 26.39,8.39 U12.P$1 26.39,7.7 v26,7.7 | U12.P$14 30.89,3.85 U12.P$12 | U12.P$20 v30.89,10.8 v30.9,10.8 | U10.P$3 4.77,25.3 v4.8,25.3 | v4.4,30.8 4.4,30.74 C29.2 | R3.1 R2.1 R1.1 5.5,28.98 v5.5,30.54 | C33.2 24.89,9.36 v24.89,8.38 24.89,7.49 C32.2 | C43.2 C42.2 19.3,45.21 v19.3,44.2 | v12.99,22.92 12.99,25.11 12.65,25.45 11.61,25.45 C11.2
  Top 0.61: C10.2 C11.2 | C34.2 C35.2 28.72,25.8 v29.4,25.8 | C32.2 24.96,7.49 | C28.2 C29.2 | C45.2 C44.2 v13.21,44.04
  Route2 0.61: 12.7,42.67 13.21,43.18 v13.21,44.04 13.21,44.45 12.29,44.45 v12.29,47.85 | 12.7,42.67 4.06,42.67 3.05,41.66 3.05,29.97 | v19.3,44.2 19.3,43.18 18.8,42.67 12.7,42.67
  Bottom 0.127: 14.73,28.45 14.73,28.27 U15.P$PAD | 14.73,28.09 14.63,28.09 U15.P$PAD | v5.61,18.97 5.18,18.54 5.18,18.47 U16.P$5 | 14.15,28 14.28,27.96 14.33,27.91 U15.P$PAD | U7.P$10 4.29,14.53 4.3,14.52 | 21.13,9.87 21.13,9.88 C5.- | 9.14,22.83 9.14,23.57 8.71,24 8.53,24 U8.P$5 | C3.- 15.77,5.21 | 13.34,44.32 13.18,44.48 13.06,44.2
  Bottom 0.254: 4.8,16.45 4.8,15.7 v5.4,15.7 | U7.P$5 5.2,12.91 5.2,14.52 4.3,14.52 v4.3,15.2 | 14,28.65 14,28 14.15,28 | 13.65,27.4 U15.P$PAD 13.9,27.15 U15.P$4 17.27,27.15 17.27,28.76 v17.61,28.76 | U5.P$13 17.4,21.69 v17.4,22.23 | 14.73,28.65 14.73,28.45 | 14.73,28.15 14.73,28.09 14.73,27.94
  Bottom 0.305: U11.A2 U11.A1 26.99,16.3 v26.5,16.3 | U5.P$13 U5.P$12 U5.P$11 U5.P$10 | U5.P$10 U5.P$9 | U5.P$10 U5.P$4 | U8.P$5 8.39,25.61 C14.2 | U8.P$12 6.89,20.52 7.89,20.52 | 7.89,20.52 U8.P$10 | U8.P$7 9.14,22.83 9.4,22.83 9.4,20.5 v8.5,20.5 8.5,20.52 7.89,20.52 | U16.P$3 3.97,18.5 | U16.P$8 4.8,16.45 U16.P$9 | U4.B2 26.5,14.73 v26.5,13.1
  Bottom 0.406: C27.2 C26.2 35.1,25.07 v35.1,25.1 | C16.2 C17.2 v30.8,12.4 | C23.2 28.47,27.73 C22.2 29.5,27.72 v29.5,27.7 | C20.2 C21.2 10.38,8.9 v9.89,8.9 | C38.2 C39.2 1.54,16.3 v2.1,16.3 | IC1.2 6.78,10.72 C41.2 5.6,10.72 v5.6,10.7 | 30.49,20.8 U2.P$7 35.1,20.78 v35.1,20.8 | C19.2 v2.01,20.11 v2,20.1 | U16.P$3 3,18.45 v3,18.5 | U9.P$2 31,25.2 v31,25.7 | C47.2 3.56,22.21 C46.2 v2.03,21.29 | C40.2 4.71,3.33 v4.7,3.31 | R9.1 6.13,3.32 v6.15,3.3
  Bottom 0.61: 16,5 15.78,5.22 15.78,5.21 15.77,5.21 v14.35,5.21 | 21.5,9.5 21.13,9.87 21,10 | C18.2 C19.2 | v12.19,30.99 12.19,30.57 C37.2 C36.2 | C2.- 21.5,5.33 v20.07,5.33 | C1.- 27.21,3.81 v24.77,3.81 | C4.- 27.21,11.81 v24.89,11.81 | C5.- 21.5,10.16 v20.07,10.16 | C8.- 13.75,12.19 v12.19,12.19 | C9.- 19.47,14.48 v17.65,14.48 | C7.- 25.18,13.97 v23.11,13.97 | C6.- 15.78,8.64 v14.35,8.64 | U22.3 14.45,45.44 13.34,44.32 13.21,44.2 | U22.6 6.95,44.87 7.62,44.2 13.06,44.2 v13.21,44.04 | C15.2 C48.2 19.42,24.58 v19.41,24.59 | C24.2 v18.03,24.59 | C30.2 30.92,16.32 v30.94,16.31
  other vias: 1.3,11.3 1.7,8.2 1.1,8.2 1.3,10.5 1.3,9.7 34.8,11.43
  pour Route2: 1,32.02 35,32.02 35,11 32,11 32,1 1,1
  pour Route15: 1,1 32,1 32,11 35,11 35,32.02 1,32.02
  pour Route6: 1,32.02 35,32.02 35,11 32,11 32,1 1,1
  pour Top: 0.9,11.6 2.5,11.6 2.5,9.4 0.9,9.4
  pour Top: 0.9,8.6 2.9,8.6 2.9,8 0.9,8
I2C_PROGRAMMABLE_PULLUP_LEVEL
  Top 0.127: 33.1,14.89 33.1,14.91 32.82,14.91
  Top 0.406: 32.8,14.9 32.8,14.89 33.1,14.89 U18.B1
  Top 0.61: R4.2 32.82,15.42 32.82,14.91 R5.2
KL03_CLKOUT32K  (via drill 0.2)
  Top 0.127: v26.54,1.8 U12.P$8 | v28.7,21.11 28.04,21.11 27.96,21.18 U13.P$9
  Route4 0.127: v13.59,29.9 15.75,29.9 22.33,23.32 24.21,23.32 | 24.21,23.32 26.49,23.32 v28.7,21.11 | v26.54,1.8 26.54,12.34 24.46,14.43 24.46,21.77 24.21,22.02 24.21,23.32
  Bottom 0.127: v26.54,1.8 27.25,1.8 TP40.TP | v13.59,29.9 13.64,29.84 U15.P$21
KL03_EXTAL0
  Bottom 0.203: U15.P$5 18.3,26.65 U17.P$1
KL03_I2C0_SCL/KL03_LPUART0_TX  (via drill 0.2)
  Top 0.127: 3.85,18.61 6.53,15.93 6.93,15.93 U3.P$9 | 3.85,18.61 3.53,18.92 3.53,19.33 4.67,20.47 4.67,20.8 TP6.TP | v4.24,24.84 4.14,24.94 4.14,26.49 U10.P$2 | 3.85,18.61 3.02,17.78 v2.92,17.78 | v28.57,7.49 28.25,7.49 26.42,5.66 26.42,4.85 U12.P$5 | v29.39,19.68 28.85,20.22 27.96,20.22 U13.P$7 | v31.9,16.71 R4.1
  Route4 0.127: v29.44,22.48 29.44,21.06 29.72,20.78 29.72,20.02 v29.39,19.68
  Route7 0.127: v2.92,17.78 3,17.78 3.53,18.31 3.53,24.13 v4.24,24.84
  Bottom 0.127: 2.92,17.83 2.82,17.83 1.7,16.71 1.37,16.71 0.89,16.23 0.89,13.41 1.78,12.52 2.36,12.52 2.49,12.39 4.45,12.39 4.78,12.72 4.78,13.11 4.57,13.31 4.29,13.31 U7.P$7 | 2.92,17.83 3.56,17.83 U16.P$2 | 7.77,29.82 10.74,29.82 10.87,29.69 10.87,29.23 11.94,28.17 12.04,28.17 U15.P$17 | 7.77,29.82 7.62,29.67 7.62,26.26 | 7.62,26.26 7.62,24.59 7.87,24.33 7.87,24.08 U8.P$4 | v4.24,24.84 4.24,25.45 5.05,26.26 7.62,26.26 | v2.92,17.78 2.92,17.83 | 29.16,22.78 27.2,22.78 26.67,23.32 25.09,23.32 24.21,22.43 24.21,22.02 24.46,21.77 24.46,21.36 23.8,20.7 23.09,20.7 22.61,21.18 U5.P$2 | 29.16,22.78 31.5,25.12 31.5,25.91 30.5,26.9 30,26.9 | 30,26.9 25.22,26.9 24.54,26.21 U9.P$6 | 31.98,16.64 32.03,16.69 32.03,18.16 | 31.98,16.64 31.11,15.77 29.59,15.77 29.06,15.24 27.99,15.24 U4.A1 27.94,15.19 27.64,14.88 27.64,13.59 28.57,12.65 v28.57,7.49 | 32.03,18.16 U2.P$5 | 32.03,18.16 29.39,18.16 | 29.39,18.16 29.06,18.16 28.25,17.35 28.02,17.35 U11.B3 | 29.39,18.16 v29.39,19.68 | 31.98,16.64 v31.9,16.71 | v29.44,22.48 29.18,22.73 29.16,22.78 | 30,26.9 30,28.57 26.47,32.11 8.76,32.11 7.64,30.99 7.64,30.15 7.75,30.05 7.75,29.87 7.77,29.82
KL03_I2C0_SDA/KL03_LPUART0_RX  (via drill 0.2)
  Top 0.127: v4.04,19.13 4.42,19.13 4.7,18.85 TP5.TP 4.78,18.82 6.43,17.17 U3.P$11 | v7.9,23.34 7.9,25.83 4.9,28.83 3.99,28.83 3.48,28.32 U10.P$6 | 32.18,12.39 32.18,10.01 30.28,8.1 30.28,7.21 27.41,4.34 27.41,3.96 U12.P$6 | 32.18,12.39 32.79,13.01 R5.1 | v29.21,20.57 28.52,20.57 28.4,20.7 27.96,20.7 U13.P$8 | v27.38,15.65 28.27,15.65 31.5,12.42 32.13,12.42 32.18,12.39
  Route4 0.127: v27.38,15.65 27.38,19.15 28.8,20.57 v29.21,20.57
  Route7 0.127: 6.82,24.42 4.04,21.64 v4.04,19.13 4.01,19.07 4.01,18.16 3.38,17.53 3.38,15.85 3.02,15.49 3.02,14.25 3.53,13.74 v3.53,13.13 | 6.82,24.42 11.58,29.18 v11.94,29.18 11.96,29.23 11.96,29.52 12.37,29.92 12.37,30.1 13.39,31.11 23.52,31.11 28.22,26.42 v28.27,26.39 28.27,22.25 29.21,21.31 v29.21,20.57 | 6.82,24.42 v7.9,23.34
  Bottom 0.127: v4.04,19.13 4.55,18.62 4.55,18.47 U16.P$4 | v11.94,29.18 12.04,29.08 U15.P$18 | v3.53,13.13 3.73,12.93 4.27,12.93 U7.P$6 | v7.9,23.34 8.64,23.34 U8.P$6 | v27.38,15.65 U4.A2 | U2.P$6 30.53,19.36 29.31,20.57 v29.21,20.57 29.16,20.55 28.78,20.55 27.53,19.3 | 27.53,19.3 27.53,18.9 27.99,18.44 U11.C3 | U5.P$3 21.16,20.68 22.73,20.68 24.08,19.33 27.48,19.33 27.53,19.3 | v28.27,26.39 28.09,26.21 27.43,26.21 U9.P$1
KL03_RESET_B/LED2/TS5A3154_EN  (via drill 0.2)
  Top 0.127: v1.63,9.02 2.41,9.02 3.35,8.08 U14.B1 | v15.04,30.53 14.45,31.11 13.39,31.11 12.62,30.35 10.59,30.35 LED2.A 10.57,30.4 9.98,30.99 9.98,31.8 9.53,32.26 4.32,32.26 3.94,32.64 3.94,39.85 R21.2
  Route4 0.127: v1.63,9.02 1.27,9.02 0.74,9.55 0.74,19.56 1.96,20.78 2.39,20.78 10.97,29.36 10.97,29.95 11.51,30.48 12.95,30.48 13.59,31.11 14.45,31.11 v15.04,30.53
  Bottom 0.127: v15.04,30.53 15.14,30.53
  Bottom 0.254: U15.P$23 14.65,29.8 15.14,29.8 15.14,30.53 15.14,31.14 18.85,31.14 TP27.TP
KL03_SPI_MISO/PAN1326_RTS  (via drill 0.2)
  Top 0.127: v13.01,20.65 12.24,20.65 12.12,20.52 U1.P$7 | v28.5,6.15 28.12,5.77 27.41,5.77 U12.P$4
  Route3 0.127: v14.63,24.92 14.63,22.28 v13.01,20.65
  Route4 0.127: v3.5,10.95 3.5,11.63 9.65,17.78 9.65,18.31 11.99,20.65 v13.01,20.65
  Route7 0.127: v28.5,6.15 28.27,6.15 24.64,9.78 23.8,9.78 13.01,20.57 v13.01,20.65
  Bottom 0.127: v14.63,24.92 14.63,25.53 U15.P$8 | TP33.TP 3.05,7.42 2.54,7.92 2.54,9.98 v3.5,10.95
KL03_SPI_MOSI/PAN1326_CTS  (via drill 0.2)
  Top 0.127: v12.47,19.41 12.47,19.63 12.12,19.99 U1.P$6 | v6.22,15.06 4.7,13.54 4.7,13.06 TP2.TP | v25.83,5.99 26.39,6.55 26.39,6.63 U12.P$3
  Route3 0.127: v13.64,24.21 13.64,22 12.47,20.83 v12.47,19.41
  Route7 0.127: v6.22,15.06 8.13,15.06 11.21,18.15 | v12.47,19.41 11.21,18.15 | v25.83,5.99 23.37,5.99 11.21,18.15
  Bottom 0.127: v13.64,24.21 13.16,24.69 13.16,25.53 U15.P$11
KL03_SPI_SCK  (via drill 0.2)
  Top 0.127: v34.85,16.26 35.51,15.6 35.51,15.19 34.72,14.4 34.42,14.4 U18.C2 | v12.14,18.26 11.73,18.26 11.28,18.72 11.28,19.1 U1.P$4 | v3.89,15.8 4.04,15.95 4.67,15.95 TP4.TP
  Route3 0.127: v34.85,16.26 34.65,16.26 29.29,21.61 24.71,21.61 23.8,20.7 20.37,20.7 | 20.37,20.7 17.25,20.7 16.05,21.89 14.71,21.89 13.51,20.7 13.51,19.74 12.14,18.36 v12.14,18.26 | v10.67,27.46 11.89,28.68 16.82,28.68 19.05,30.91 19.99,30.91 20.37,30.53 20.37,20.7
  Route4 0.127: v3.89,15.8 7.39,19.3 7.39,24.18 v10.67,27.46
  Bottom 0.127: v10.67,27.46 11.18,27.96 11.58,27.96 11.89,27.66 12.04,27.66 U15.P$16
KL03_SWD_CLK/LED1/TS5A3154_IN  (via drill 0.2)
  Top 0.127: v1.96,7.16 U14.D2 | v13.79,30.61 14.1,30.3 14.1,29.69 13.08,28.68 11.73,28.68 11.46,28.96 10.59,28.96 LED1.A | v2.54,45.97 1.91,46.61 1.91,46.74 R17.2
  Route3 0.127: v1.96,7.16 1.96,7.75 4.9,10.69 4.9,17.55 v6.35,19 | v2.54,45.97 2.54,34.04 4.47,32.11 12.29,32.11 v13.79,30.61
  Route7 0.127: v6.35,19 6.35,21.01 14.1,28.75 14.1,30.3 v13.79,30.61
  Bottom 0.127: v13.79,30.61 14.05,30.35 14.15,30.3
  Bottom 0.254: U15.P$22 14.15,30.3 14.45,30.3 TP28.TP
KL03_SWD_DIO/LED3/SI4705_!RST  (via drill 0.2)
  Top 0.127: v28.04,19.1 27.84,19.1 27.36,19.58 U13.P$5 | v11.43,31.6 10.59,31.6 LED3.A | v1.85,52.22 5.92,52.22 6.66,52.96 R12.2
  Route4 0.127: v1.85,52.22 1.85,34.34 4.6,31.6 v11.43,31.6
  Route7 0.127: v28.04,19.1 28.04,21.95 23.14,26.85 v23.14,28.96
  Bottom 0.127: v23.14,28.96 22.94,29.16 22.86,29.26 | v11.43,31.6 19.3,31.6 20.37,30.53 20.37,29.26
  Bottom 0.254: U15.P$24 15.7,29.25 15.7,30.68 18.14,30.68 18.14,29.26 20.37,29.26 22.86,29.26 TP26.TP
KL03_VDD  (via drill 0.2)
  Top 0.127: v5.21,21.36 4.52,21.36 3.94,20.78 1.83,20.78 1.8,20.8 1.07,20.8 TP25.TP
  Top 0.305: v35,15.4 U18.A2
  Route3 0.813: 15.81,18 29,18 29,15 35,15 v35,15.4 | v11.18,5.84 13.34,5.84 13.34,16.5 15.81,16.5 15.81,18 | v14.95,21.3 15.81,21.3 15.81,18
  Route7 0.127: v17.42,30.02 17.42,29.29 15.14,27 15.14,21.49 14.96,21.31 v14.95,21.3
  Bottom 0.127: v5.21,21.36 5.56,21.36 6.76,20.17 8.13,20.17 8.31,19.99 9.91,19.99 11.12,21.21 11.3,21.3 | 9.86,24 9.86,23.96
  Bottom 0.254: U15.P$13 11.18,26.15 11.18,25.4 9.8,25.4 | U15.P$3 16.76,27.65 16.76,29.41 17.42,29.41 v17.42,30.02
  Bottom 0.406: R7.1 10.08,5.84 | 10.08,5.84 R6.1 | C36.1 C37.1 10.21,28 9.8,28 9.8,25.4 9.8,24 9.86,24 9.9,24 | 9.83,23.96 9.86,23.96 11.3,23.96 11.3,21.3 v14.95,21.3 | v11.18,5.84 10.08,5.84
KL03_XTAL0
  Bottom 0.254: U15.P$6 17.27,26.15 17.27,25.6 22.5,25.6 U17.P$2
L3GD20H_DEN
  Bottom 0.127: U5.P$8 19.33,19.38 18.87,19.38 18.82,19.33 17.45,19.33 TP22.TP
N$1
  Top 0.406: R1.2 LED1.C
N$2
  Top 0.406: R2.2 9.09,30.3 LED2.C
N$3
  Top 0.406: R3.2 LED3.C
N$5
  Bottom 0.406: L1.2 4.9,11.89 4.9,9.6 5.83,9.6 IC1.1
N$6
  Bottom 0.406: IC1.4 7.73,5.95 R8.2 R9.2
N$15
  Top 0.254: U21.P$13 6.37,49 4.06,51.31 R28.2
N$16  (via drill 0.2)
  Top 0.127: v10.95,46.02 10.49,46.48 U21.P$1 | v19.96,42.37 20.68,41.66 R29.2
  Route3 0.127: v10.95,46.02 16.31,46.02 v19.96,42.37
N$21
  Top 0.127: U21.P$2 11.48,46.99 12.85,45.62 15.8,45.62 17.73,43.69 21.03,43.69 22.33,44.98 22.33,48.92 19.58,51.66 R30.2
N$22
  Top 0.254: U21.P$9 8.89,50.54 9.14,50.8 9.65,50.8 10.16,51.31 R31.2
N$23
  Top 0.254: U21.P$10 8.39,51.42 R35.2
N$24
  Top 0.254: U21.P$18 6.37,46.5 4.06,44.2 3.7,44.2 R10.1
N$25
  Top 0.254: U21.P$17 5.85,47 4.06,45.21 R11.1
N$26
  Top 0.254: U21.P$11 7.89,50.53 7.62,50.8 7.11,50.8 R12.1
N$27
  Top 0.254: U21.P$8 9.39,50.03 9.65,50.29 11.18,50.29 11.68,50.8 R16.1
N$28
  Top 0.254: U21.P$16 5.34,47.5 4.57,46.74 R17.1
N$30
  Top 0.254: U21.P$15 4.32,48 4.06,48.26 R18.1
N$31
  Top 0.254: U21.P$14 5.8,48.5 4.52,49.78 R19.1 3.05,49.78
N$32
  Top 0.254: U21.P$12 7.39,50.02 7.11,50.29 6.1,50.29 5.59,50.8 R20.1
N$33
  Top 0.254: U21.P$20 7.89,44.97 7.62,44.7 6.6,44.7 6.1,44.2 R21.1
N$34
  Top 0.254: U21.P$7 12.01,49.6 13.21,50.8 R22.1
N$35
  Top 0.254: U21.P$19 7.39,45.49 7.11,45.21 6.1,45.21 5.08,44.2 5.08,43.83 R23.1
N$36
  Top 0.254: U21.P$21 8.39,44.45 8.13,44.2 8.13,43.83 R24.1
N$37
  Top 0.254: U21.P$22 8.89,44.45 9.14,44.2 R25.1
N$38
  Top 0.254: U21.P$23 9.39,44.97 10.16,44.2 10.16,43.83 R26.1
N$39
  Top 0.254: U21.P$24 9.89,45.49 11.18,44.2 11.32,44.2 R27.1
N$104
  Bottom 0.305: U8.P$2 6.89,25.61 C14.1
N$125
  Bottom 0.127: U7.P$1 6.1,14.53 6.53,14.53 6.6,14.61 7.77,14.61 9.47,12.9 10.06,12.9 10.41,12.55 10.41,11.18 C21.1
N$126  (via drill 0.2)
  Route7 0.127: v6.83,12.85 6.83,11.18 v9.17,8.84
  Bottom 0.127: v6.83,12.85 6.38,13.31 6.1,13.31 U7.P$4 | v9.17,8.84 8.61,9.4 8.61,10.49 9.25,11.12 C20.1
N$159
  Bottom 0.305: C24.1 19.35,23.49 U5.P$14
N$236
  Top 0.61: D1.P$2 18.7,4.57 D2.P$1
N$237
  Top 0.61: D2.P$2 23.18,4.62 D3.P$1
N$238
  Top 0.61: D3.P$2 18.73,9.54 D4.P$1
N$239
  Top 0.61: D4.P$2 14.4,9.54 D5.P$1
N$240
  Top 0.61: D5.P$2 19.83,14.87 D6.P$1
N$241
  Top 0.61: D6.P$2 21.93,14.81 D7.P$1
N$242
  Top 0.61: D7.P$2 21.93,20.29 D8.P$1
N$243
  Top 0.61: D8.P$2 16.42,20.29 D9.P$1
N$244
  Top 0.61: D10.A 20.81,25.71 D9.P$2
PAN1326B_AUD_CLK  (via drill 0.2)
  Top 0.127: v32.54,8.43 TP39.TP U12.P$19 | v23.39,22.02 23.44,22.07 24.16,22.07 24.51,21.72 25.22,21.72 U13.P$17
  Route7 0.127: v23.39,22.02 23.7,22.02 23.75,22.07 24.16,22.07 32.54,13.69 v32.54,8.43
  Bottom 0.127: v32.54,8.43 TP39.TP
PAN1326B_AUD_FSYNC  (via drill 0.2)
  Top 0.127: v24.71,22.23 U13.P$16 | v27.13,2.82 26.9,3.05 26.42,3.05 U12.P$7
  Bottom 0.127: v24.71,22.23 28.3,22.23 30.02,20.5 30.02,20.42 30.66,19.79 32.41,19.79 33.05,19.15 33.05,6.12 TP37.TP 29.92,3.02 29.72,2.82 v27.13,2.82
PAN1326B_AUD_IN  (via drill 0.2)
  Top 0.127: v31.57,7.57 30.81,7.57 U12.P$18 | v25.35,22.81 25.83,22.33 U13.P$15
  Route4 0.127: v25.35,22.81 25.35,14.96 31.57,8.74 v31.57,7.57
  Bottom 0.127: TP38.TP v31.57,7.57
PAN1326B_AUD_OUT  (via drill 0.2)
  Top 0.127: v15.54,1.6 TP20.TP | v31.04,6.66 31.77,6.66 U12.P$17
  Route3 0.127: v15.54,1.6 20.6,1.6 25.65,6.66 v31.04,6.66
PAN1326B_RF  (via drill 0.2)
  Top 0.127: v21.79,1.04 21.06,1.04 TP21.TP | v31.6,2.31 31.6,2.87 31.77,3.05 U12.P$13
  Route3 0.127: v21.79,1.04 30.33,1.04 v31.6,2.31
PAN1326B_TX_DBG
  Top 0.127: TP19.TP 18.09,1.07 22.58,5.56 22.58,11.76 22.73,11.91 23.93,11.91 24.64,11.2 29.64,11.2 30,10.85 30,9.53 29.67,9.2 29.29,9.2 28.7,8.61 28.7,8.33 27.94,7.57 27.41,7.57 U12.P$2
SCALED_SENSOR_SUPPLY  (via drill 0.2, 0.41, 1.02)
  Top 0.127: v12.57,1.63 12.06,1.12 TP24.TP | U13.P$10 27.96,21.72 28,21.72 | C33.1 24.97,10.67 | U12.P$10 29.11,1.8 U12.P$10
  Top 0.305: U1.P$14 8.9,21 8.9,23.3 v9.8,23.3 9.8,24.14 C10.1 | U3.P$7 7.47,13.1 9.47,13.1 | 9.47,13.1 v11.6,13.1 13.15,13.1 C12.1 12.22,13.72 C13.1 | U3.P$3 9.47,13.1 | U12.P$15 31.74,4.8 30,4.8 29.99,4.79 U12.P$11 | U18.A1 v33.91,16.29 v33.9,16.3 | U3.P$13 8.47,18 v8.8,18 | U1.P$1 9.78,18.1 v10.16,18.1 | U13.P$11 28,22.23 28,21.72 28,21.7 28.72,21.7 C35.1 | C28.1 2.07,28 v2.1,28 2.1,26.52 U10.P$1 | U14.A1 3.87,8.1 | 29.6,10.67 24.97,10.67 24,10.67 v24,10.29 24,6.22 24.89,6.22 24.89,6.1 24,6.1 24,0.76 29.08,0.76 U12.P$10 29.08,1.91
  Top 0.406: C32.1 24.93,5.3 v25,5.3 | U12.P$22 29.6,9.7 29.6,10.67 | U12.P$11 29.99,1.8 U12.P$10 | 3.87,8.1 v4.85,8.1 | C33.1 29.46,10.66 29.46,10.67 | C34.1 30,23.17 v31.05,23.17
  Top 0.61: C35.1 C34.1 | C28.1 C29.1 | C10.1 C11.1
  Bottom 0.127: U11.B1 27.13,17.27 27.56,17.27 27.89,16.94 U11.A3 | 3.97,16.71 v2.82,16.71 | 26.31,29 26.31,29.01 C23.1
  Bottom 0.254: U4.B1 U4.C1 U4.D1 29.5,13.73 C17.1 | C38.1 2.72,13.71 U7.P$8 | U7.P$2 6.8,14.12 v6.8,14.1 | U5.P$15 U5.P$16 21.15,21.99 U5.P$1 v22.7,21.69 v22.7,21.7 | U5.P$5 v22.7,19.69 v22.7,19.7
  Bottom 0.305: C16.1 C17.1 | U8.P$1 6.39,24.5 v5.4,24.5 | U16.P$1 3.97,17.05 3.97,16.71 U16.P$10 | 3.97,17.2 3.97,17.4 4.2,17.4 4.2,17.86 U16.P$6 7.6,17.86 7.6,19.8 5.6,19.8 v5.6,19.7 | U8.P$14 5.4,22.33 v5.4,22.3 | U11.A3 29,16.85 29,17.6 29.88,17.6 C30.1 | U11.C1 U11.B1 | U5.P$15 19.85,22.61 C48.1
  Bottom 0.406: U2.P$3 U2.P$2 33.75,22.23 C26.1 C27.1 31.5,23.77 v31.5,23.8 | C23.1 27.5,29.03 | 27.5,29.03 v27.5,28.4 | C39.1 C38.1 | C18.1 C19.1 5.6,20.11 v5.6,19.7 | 27.5,29.03 28.47,29.03 C22.1 | R6.2 9.02,7.71 v9.02,7.75 | U9.P$5 23.61,25.2 23.61,28.5 24.9,28.5 24.9,29 26.31,29 26.5,29 | C17.1 v29.5,12.4 | 2.72,13.71 2.7,13.71 v2.7,12.9 | C46.1 2.03,24.02 C47.1 5.4,24.02 v5.4,24.5
  Bottom 0.61: C48.1 C15.1 | 29.88,17.6 30.91,17.6 v30.94,17.63
  other vias: 1.27,1.27
  pour Route5: 1,32.02 35,32.02 35,11 32,11 32,1 1,1
SI4705_FMI
  Top 0.127: TP13.TP 26.31,30.05 27.3,31.04 32.72,31.04 33.53,30.23 33.53,28.5 32.26,27.23 32.26,21.46 29.13,18.34 26.98,18.34 25.86,19.46 25.86,19.58 U13.P$2
SI4705_GPO1  (via drill 0.2)
  Top 0.127: v34.52,29.52 35.03,30.02 TP18.TP | v23.29,21.21 23.6,21.21 24.08,20.73 25.22,20.73 U13.P$19
  Route3 0.127: v34.52,29.52 29.79,29.52 22.2,21.92 22.2,21.49 22.5,21.18 23.27,21.18 v23.29,21.21
SI4705_GPO2  (via drill 0.2)
  Top 0.127: v32.28,29.01 33.02,29.74 TP17.TP | v23.95,21.57 24.28,21.57 24.64,21.21 25.22,21.21 U13.P$18
  Route3 0.127: v32.28,29.01 31.6,29.01 25.91,23.32 25.09,23.32 23.95,22.17 v23.95,21.57
SI4705_LOUT
  Top 0.127: TP16.TP 30.99,30.02 30.73,30.02 26.36,25.65 26.36,22.33 U13.P$14
SI4705_LPI
  Top 0.127: TP14.TP 27.05,30.05 28.35,30.05 29.08,30.79 31.34,30.79 31.77,30.35 31.77,24.23 32,24 32,21.59 29.01,18.59 27.71,18.59 26.87,19.43 26.87,19.58 U13.P$4
SI4705_ROUT
  Top 0.127: TP15.TP 29.06,30.05 30.33,30.05 30.81,30.53 31.22,30.53 31.52,30.23 31.52,29.82 29.92,28.22 29.31,28.22 26.87,25.78 26.87,22.33 U13.P$13
TPS82675_EN  (via drill 0.2)
  Top 0.127: v2.79,10.95 3.17,10.57 3.17,10.46 U19.B2 | v3.53,14.45 1.12,14.45 1.02,14.55 TP9.TP
  Route3 0.127: v2.79,10.95 2.79,11.68 4.04,12.93 4.04,13.95 v3.53,14.45
  Route4 0.127: v12.88,29.9 12.88,29.41 11.43,27.96 10.36,27.96 3.5,21.11 3.5,16.13 3.38,16 3.38,14.61 v3.53,14.45
  Bottom 0.127: v12.88,29.9 13.13,29.64 13.13,29.26 U15.P$20
TPS82675_MODE  (via drill 0.2)
  Top 0.127: v1.68,12.01 2.31,12.01 2.87,11.46 3.17,11.46 U19.B1 | v1.25,18.19 1.25,18.64 1.02,18.87 TP12.TP
  Route3 0.127: v1.68,12.01 1.68,16 1.25,16.43 v1.25,18.19
  Route7 0.127: v13.66,24.92 13.44,24.92 9.02,20.5 9.02,20.3 8.64,19.91 8.61,19.91 4.8,16.1 4.8,13.69 3.12,12.01 v1.68,12.01
  Bottom 0.127: v13.66,24.92 13.66,25.53 U15.P$10
TPS82675_VOUT
  Top 0.127: TP8.TP 1.73,13.16 3,11.89 3.79,11.89 3.98,11.8
  Top 0.254: 5.7,6.6 3.5,6.6 3.4,6.6 3.37,6.6 U14.B2
  Top 0.406: U19.A1 3.98,11.8 4.9,11.8 4.9,9 5.7,9 5.7,6.6
TPS82740_LOAD  (via drill 0.2)
  Top 0.127: v2.41,5.49 2.74,5.82 2.74,5.97 U6.B1 | v5.33,1.04 5.99,1.04 6.04,1.09 TP1.TP
  Route3 0.127: v2.41,5.49 2.41,5.05 4.17,3.3 4.17,1.91 5.03,1.04 v5.33,1.04
TPS82740_VOUT  (via drill 0.2)
  Top 0.127: v2.49,1.55 2.97,1.07 3.05,1.07 TP7.TP | v1.37,5.71 1.65,5.71 1.85,5.92 U6.C1
  Top 0.254: U6.C1 1.96,6.36 2.2,6.6 2.87,6.6 U14.C2
  Route3 0.127: v2.49,1.55 2.49,4.6 v1.37,5.71
TPS82740A_CTL/TPS82740A_EN  (via drill 0.2)
  Top 0.127: U6.B3 2.77,3.99 2.77,4.95 U6.B2 2.82,4.98 3.07,4.98 3.43,5.33 5.77,5.33 9.53,1.57 v9.58,1.55 TP23.TP
  Route3 0.127: v12.19,22.89 12.19,22.45 11.56,21.82 11.56,15.47 10.41,14.33 10.41,2.87 9.58,2.03 v9.58,1.55
  Bottom 0.127: v12.19,22.89 12.65,23.34 12.65,25.53 U15.P$12
TPS82740A_VSEL1  (via drill 0.2)
  Top 0.127: v5.41,3.63 5.08,3.96 3.58,3.96 U6.A3
  Bottom 0.127: 5.41,2.77 5.41,2.54 5.49,2.46 5.49,1.91 5.11,1.52 3.56,1.52 TP35.TP | 5.41,2.77 v5.41,3.63 | 5.41,2.77 6.91,2.77 8.56,4.42 10.46,4.42 11.68,5.64 11.68,6.83 14.25,9.4 14.25,12.04 14.86,12.65 15.67,12.65 16.36,13.34 16.36,14.05 17.22,14.91 17.22,15.54 16.94,15.82 16.94,20.02 15.16,21.79 15.16,25.53 U15.P$7
TPS82740A_VSEL2  (via drill 0.2)
  Top 0.127: v6.88,3.5 5.44,4.95 3.58,4.95 U6.A2 | v8.26,8.79 8.26,9.02 4.72,12.55 4.47,12.55 4.19,12.83 4.19,14.02 TP3.TP
  Route3 0.127: v6.88,3.5 6.88,7.42 v8.26,8.79
  Route4 0.127: v11.38,27.46 13.13,25.7 13.13,23.5 13.51,23.11 13.51,17.42 8.26,12.17 v8.26,8.79
  Bottom 0.127: v11.38,27.46 11.68,27.15 U15.P$15
TPS82740A_VSEL3  (via drill 0.2)
  Top 0.127: U6.A1 6.15,5.97 v8.1,7.92
  Route4 0.127: v11.48,29.74 11.48,29.46 2.52,20.5 2.52,18.72 2.26,18.47 2.26,17.17 1.6,16.51 1.6,12.8 2.29,12.12 2.29,10.31 v3.05,9.55
  Route7 0.127: v8.1,7.92 5.89,7.92 4.27,9.55 v3.05,9.55
  Bottom 0.127: TP34.TP v3.05,9.55 | v11.48,29.74 12.09,29.74 12.57,29.26 U15.P$19
VBATT  (via drill 0.2, 0.41, 0.51, 1.02)
  Top 0.127: v1.75,17.48 TP11.TP
  Top 0.254: U21.P$3 11.43,47.5 11.68,47.24 13.21,47.24 v13.22,47.25
  Top 0.305: U14.A2 3.87,7.2 v4.5,7.2 | U19.A2 U19.A3 3.98,8.8 v4.2,8.8 | v1.3,4 1.3,3.97 U6.C3
  Top 0.61: C45.1 C44.1 13.21,47.24
  Route14 0.61: v13.22,47.25 13.22,45.53 11.94,44.25 11.94,43.45 11.95,43.44 11.18,42.67 3.05,42.67 2.03,41.66 2.03,30.48
  Bottom 0.254: 13.21,47.26 v13.22,47.25
  Bottom 0.406: C8.+ 9.85,13.8 v11.02,13.8 | IC1.5 6.78,6.3 R8.1
  Bottom 0.508: C40.1 3.77,5.65 3.25,5.13 3.25,3.35 4.42,2.18
  Bottom 0.61: v12.28,10.58 11.88,10.18 C6.+ | v17.5,10.9 17.6,10.8 C5.+ | C4.+ C1.+ v23.3,1.8 | R7.2 11.88,3.87 C3.+ 11.88,2.49 v10.88,2.49 | C2.+ v17.6,7.5 | C9.+ 15.57,15.3 v16.62,15.3 | C7.+ 21.28,15.45 v21.05,15.45 | U22.4 11.95,49.01 12.19,48.77 12.7,48.77 13.21,48.26 13.21,47.26 | R8.1 C40.1 | 4.42,2.18 v4.83,2.18
  other vias: 34.8,28.19
  pour Route14: 1,32.02 35,32.02 35,11 32,11 32,1 1,1
VBOOSTIN  (via drill 0.41, 1.02)
  Top 0.61: D10.C 22.31,31 19.75,31 v19.75,30.3
  Route3 0.61: v19.75,30.3 19.75,27.43 15.09,27.43 15.09,26.01 9.8,26.01 9.8,29.25 | 3.5,25.15 3.5,29.25 9.8,29.25 | 3.5,25.15 3.5,20.6 7.6,20.6 7.6,12.2 9.7,12.2 arc90 v9.8,12.3 | v2.29,25.15 3.5,25.15 | 9.8,29.25 9.8,29.26
  Bottom 0.406: L1.1 C41.1 7.73,10.72 IC1.3 7.62,9.48 7.62,8.64 7.11,8.13 6.1,8.13 5.83,7.86 IC1.6
  Bottom 0.61: L1.1 8.09,12.3 v9.8,12.3

## Text on the board
Top: VBATT | Warp rev A, Top | VBOOSTIN | GND | SSSPLY
Bottom: Warp rev A, Bottom
tPlace: Warp rev A | S/N
bPlace: Designed by psm in Cambridge, MA/UK